# EAGLE schematic xio2 (EAGLE 9.2.2), part 1 of 2

## Sheet 1 of 19: Block diagram
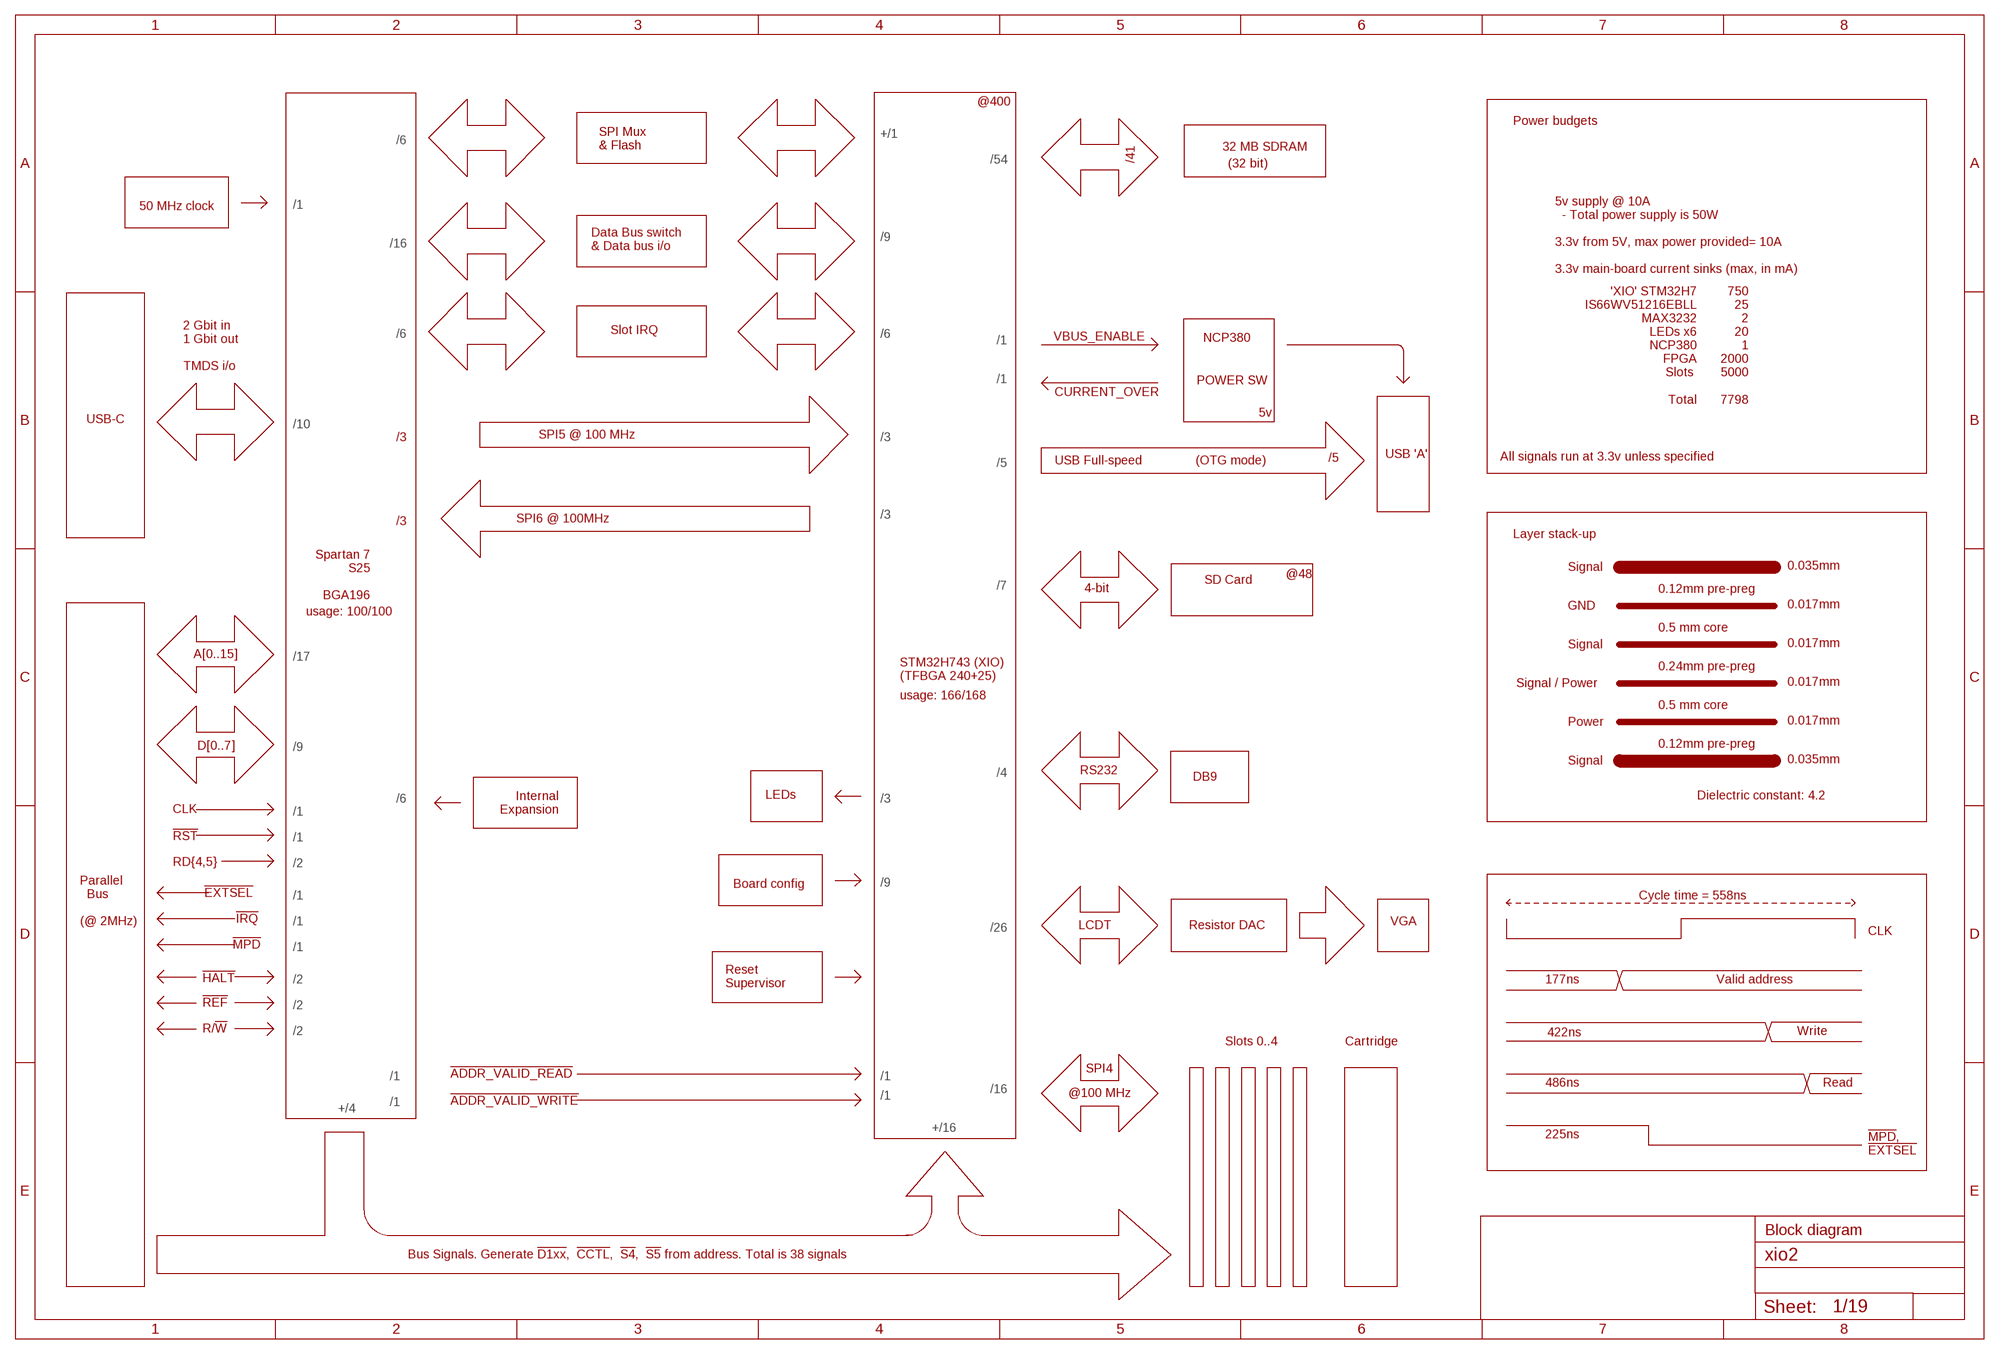
[diagram p0: schematic, sheet 1]

### Notes on the sheet
- @400
- Power budgets
- +/1
- /6 | /41
- SPI Mux
  & Flash
- 32 MB SDRAM
- /54
- (32 bit)
- 50 MHz clock | /1
- /9
- /16
- Data Bus switch
  & Data bus i/o
- 5v supply @ 10A
    - Total power supply is 50W
  
  3.3v from 5V, max power provided= 10A 
  
  3.3v main-board current sinks (max, in mA)
- 'XIO' STM32H7
  IS66WV51216EBLL
  MAX3232
  LEDs x6
  NCP380
  FPGA
  Slots 
  
  Total
- 750
  25
  2
  20
  1
  2000
  5000
  
  7798
- Slot IRQ | VBUS_ENABLE
- /6 | /6
- /1 | NCP380
- 2 Gbit in
  1 Gbit out
  
  TMDS i/o
- /1 | POWER SW
- CURRENT_OVER
- 5v
- USB-C
- /10 | SPI5 @ 100 MHz
- /3 | /3
- USB 'A' | All signals run at 3.3v unless specified
- USB Full-speed | (OTG mode) | /5
- /5
- SPI6 @ 100MHz
- /3
- /3
- Layer stack-up
- Spartan 7
      S25
  
   BGA196
- Signal | 0.035mm
- @48
- /7 | 4-bit | 0.12mm pre-preg
- SD Card
- GND | 0.017mm
- usage: 100/100
- 0.5 mm core
- Signal | 0.017mm
- A[0..15] | /17
- 0.24mm pre-preg
- STM32H743 (XIO)
  (TFBGA 240+25)
- Signal / Power | 0.017mm
- usage: 166/168
- 0.5 mm core
- Power | 0.017mm
- D[0..7] | /9 | 0.12mm pre-preg
- Signal | 0.035mm
- /4 | RS232
- DB9
- Internal
  Expansion
- LEDs | Dielectric constant: 4.2
- /6 | /3
- CLK | /1
- !RST! | /1
- RD{4,5} | /2
- !EXTSEL! | Board config | /9
- /1 | Cycle time = 558ns
- !IRQ!
- Parallel
    Bus
  
  (@ 2MHz)
- /1 | VGA
- /26 | LCDT | Resistor DAC
- CLK
- !MPD!
- /1
- !HALT! | /2 | 177ns | Valid address
- Reset
  Supervisor
- !REF! | /2
- R/!W! | /2 | Write
- 422ns
- Slots 0..4 | Cartridge
- SPI4
- /1 | !ADDR_VALID_READ! | /1
- @100 MHz | 486ns | Read
- /16
- /1
- /1 | !ADDR_VALID_WRITE!
- +/4
- +/16
- 225ns
- !MPD!,
  !EXTSEL!
- Block diagram
- Bus Signals. Generate !D1xx!,  !CCTL!,  !S4!,  !S5! from address. Total is 38 signals

## Sheet 2 of 19: XIO Power
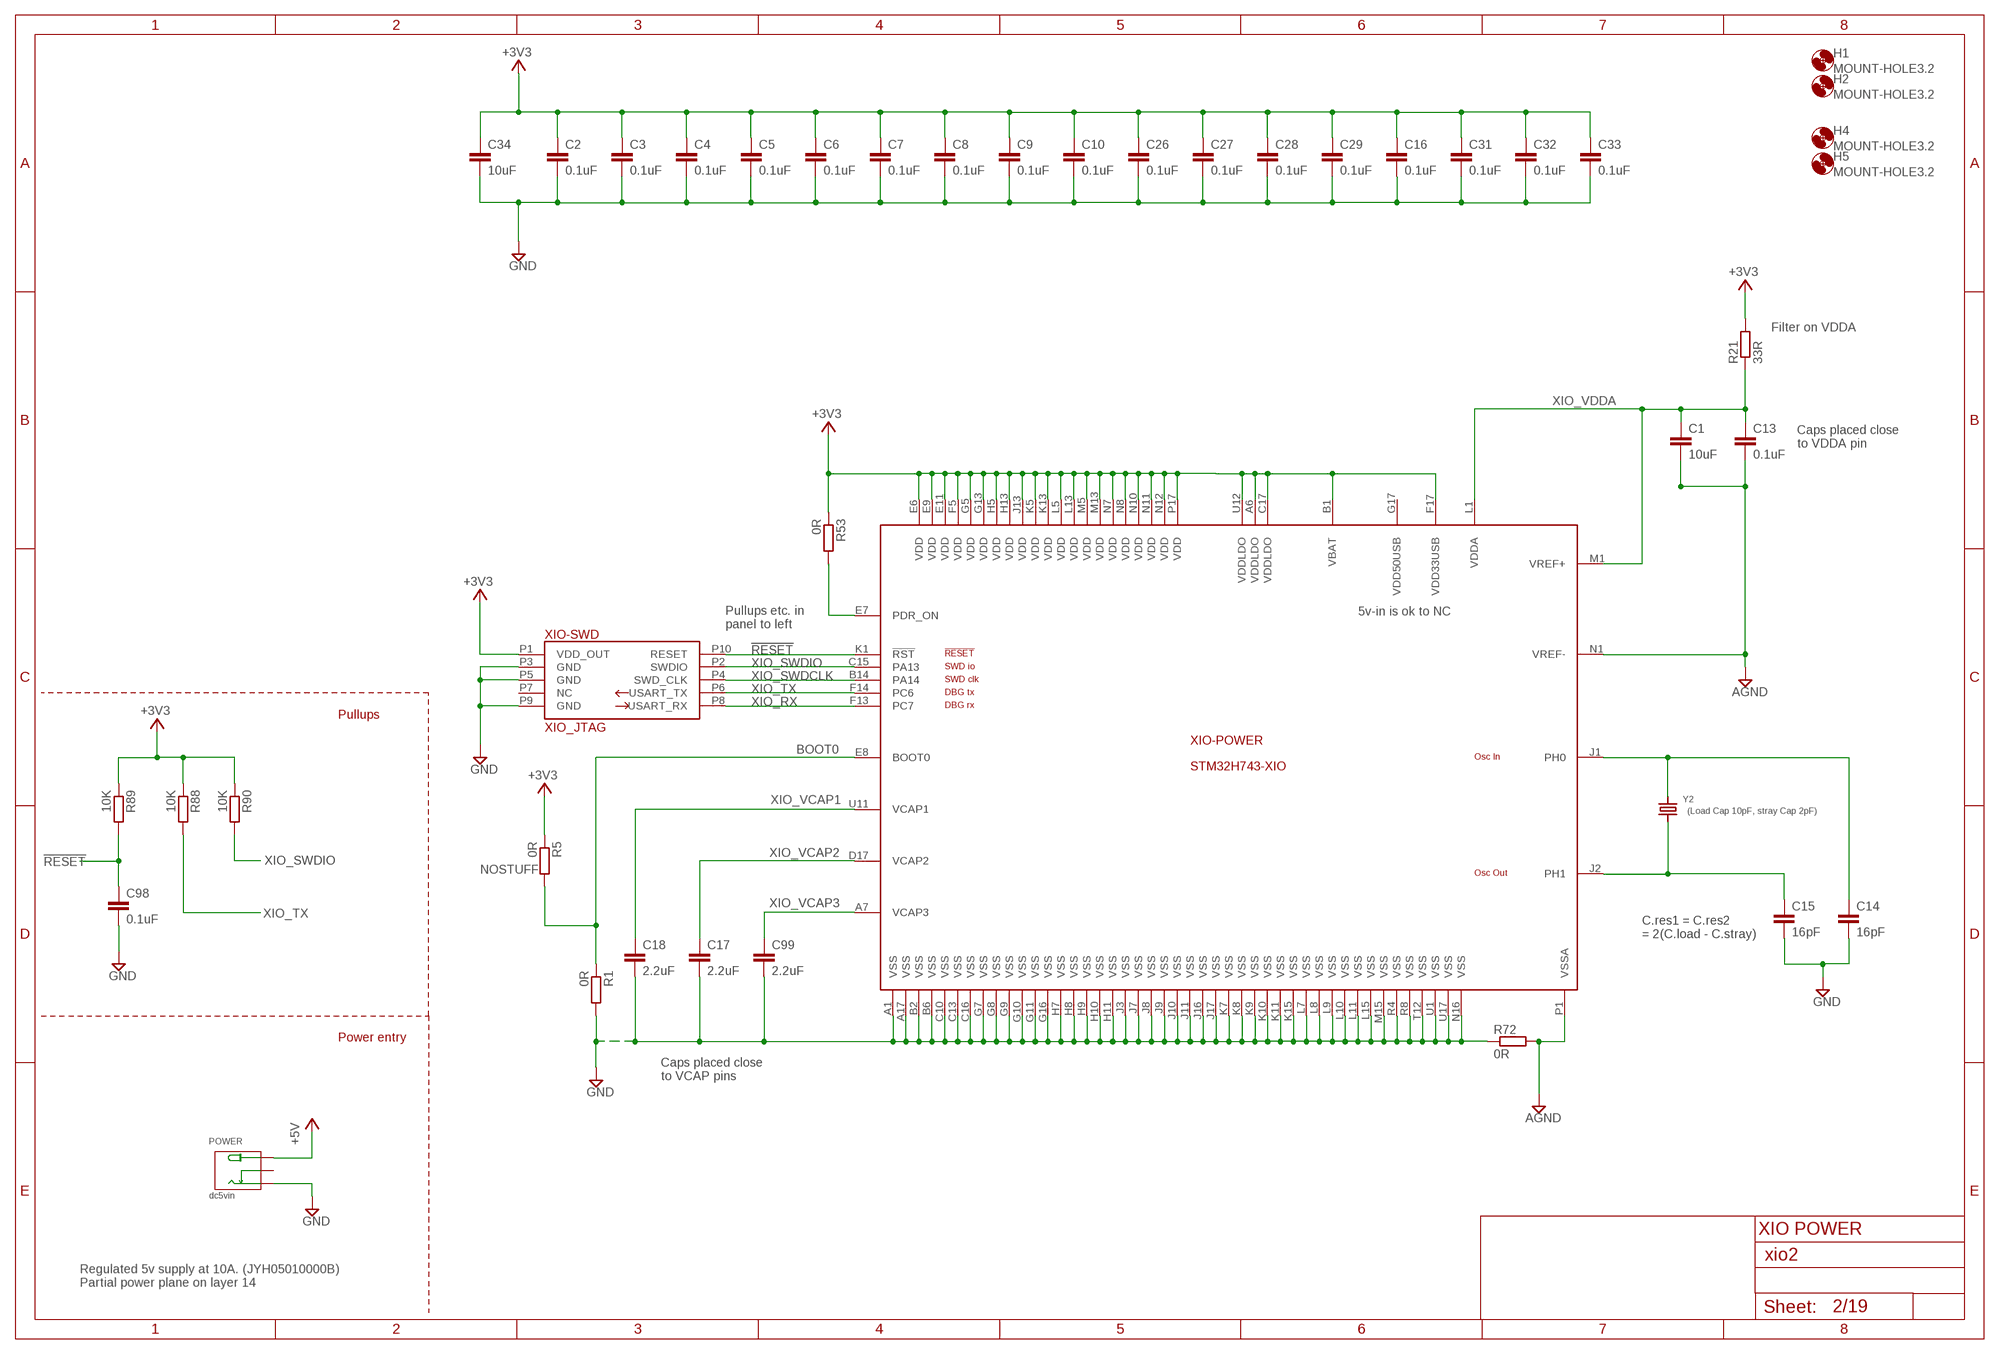
[diagram p1: schematic, sheet 2]

### Parts
C1  10uF  C-EUC0402K  [C0402K]
C2  0.1uF  C-EUC0201  [C0201]
C3  0.1uF  C-EUC0201  [C0201]
C4  0.1uF  C-EUC0201  [C0201]
C5  0.1uF  C-EUC0201  [C0201]
C6  0.1uF  C-EUC0201  [C0201]
C7  0.1uF  C-EUC0201  [C0201]
C8  0.1uF  C-EUC0201  [C0201]
C9  0.1uF  C-EUC0201  [C0201]
C10  0.1uF  C-EUC0201  [C0201]
C13  0.1uF  C-EUC0201  [C0201]
C14  16pF  C-EUC0201  [C0201]
C15  16pF  C-EUC0201  [C0201]
C16  0.1uF  C-EUC0201  [C0201]
C17  2.2uF  C-EUC0201  [C0201]
C18  2.2uF  C-EUC0201  [C0201]
C26  0.1uF  C-EUC0201  [C0201]
C27  0.1uF  C-EUC0201  [C0201]
C28  0.1uF  C-EUC0201  [C0201]
C29  0.1uF  C-EUC0201  [C0201]
C31  0.1uF  C-EUC0201  [C0201]
C32  0.1uF  C-EUC0201  [C0201]
C33  0.1uF  C-EUC0201  [C0201]
C34  10uF  C-EUC0402K  [C0402K]
C98  0.1uF  C-EUC0201  [C0201]
C99  2.2uF  C-EUC0201  [C0201]
H1  MOUNT-HOLE3.2  [3,2]
H2  MOUNT-HOLE3.2  [3,2]
H4  MOUNT-HOLE3.2  [3,2]
H5  MOUNT-HOLE3.2  [3,2]
POWER  dc5vin  CONN-POWER-JACK-2.1MM(DC-005)  [DCJ3P-14.2X11.0X9.0MM]
R1  0R  R-EU_R0201  [R0201]
R5  0R  R-EU_R0201  [R0201]
R21  33R  R-EU_R0201  [R0201]
R53  0R  R-EU_R0201  [R0201]
R72  0R  R-EU_R0201  [R0201]
R88  10K  R-EU_R0201  [R0201]
R89  10K  R-EU_R0201  [R0201]
R90  10K  R-EU_R0201  [R0201]
XIO  STM32H743-XIO  [BGA289C80P17X17_1400X1400X110]
XIO-SWD  XIO_JTAG  STM_DEBUG  [SWD_DEBUG]
Y2  FA-238 25.0000MB-K3  CRYSTALTHIN  [CRYSTAL_3.2X2.5]

### Nets
!RESET!: C98.1 R89.2 XIO-SWD.P10(RESET) XIO.K1(-POWER:!RST!) ; also sheet 4,6
+3V3 [lcd]: C2.1 C3.1 C4.1 C5.1 C6.1 C7.1 C8.1 C9.1 C10.1 C16.1 C26.1 C27.1 C28.1 C29.1 C31.1 C32.1 C33.1 C34.1 R5.1 R21.2 R53.1 R88.1 R89.1 R90.1 XIO-SWD.P1(VDD_OUT) XIO.A6(-POWER:VDDLDO) XIO.B1(-POWER:VBAT) XIO.C17(-POWER:VDDLDO) XIO.E6(-POWER:VDD) XIO.E9(-POWER:VDD) XIO.E11(-POWER:VDD) XIO.F5(-POWER:VDD) XIO.F17(-POWER:VDD33USB) XIO.G5(-POWER:VDD) XIO.G13(-POWER:VDD) XIO.H5(-POWER:VDD) XIO.H13(-POWER:VDD) XIO.J13(-POWER:VDD) XIO.K5(-POWER:VDD) XIO.K13(-POWER:VDD) XIO.L5(-POWER:VDD) XIO.L13(-POWER:VDD) XIO.M5(-POWER:VDD) XIO.M13(-POWER:VDD) XIO.N7(-POWER:VDD) XIO.N8(-POWER:VDD) XIO.N10(-POWER:VDD) XIO.N11(-POWER:VDD) XIO.N12(-POWER:VDD) XIO.P17(-POWER:VDD) XIO.U12(-POWER:VDDLDO) ; also sheet 4,5,6,7,9,10,11,12,13,14,15,16,17,18,19
+5V [Power]: POWER.+ ; also sheet 7,8,9,10,11,12,13,18,19
AGND: C1.2 C13.2 R72.2 XIO.N1(-POWER:VREF-) XIO.P1(-POWER:VSSA)
BOOT0: R1.1 R5.2 XIO.E8(-POWER:BOOT0)
GND: C2.2 C3.2 C4.2 C5.2 C6.2 C7.2 C8.2 C9.2 C10.2 C14.2 C15.2 C16.2 C17.2 C18.2 C26.2 C27.2 C28.2 C29.2 C31.2 C32.2 C33.2 C34.2 C98.2 C99.2 POWER.-1(-) R1.2 R72.1 XIO-SWD.P3(GND) XIO-SWD.P5(GND) XIO-SWD.P9(GND) XIO.A1(-POWER:VSS) XIO.A17(-POWER:VSS) XIO.B2(-POWER:VSS) XIO.B6(-POWER:VSS) XIO.C10(-POWER:VSS) XIO.C13(-POWER:VSS) XIO.C16(-POWER:VSS) XIO.G7(-POWER:VSS) XIO.G8(-POWER:VSS) XIO.G9(-POWER:VSS) XIO.G10(-POWER:VSS) XIO.G11(-POWER:VSS) XIO.G16(-POWER:VSS) XIO.H7(-POWER:VSS) XIO.H8(-POWER:VSS) XIO.H9(-POWER:VSS) XIO.H10(-POWER:VSS) XIO.H11(-POWER:VSS) XIO.J3(-POWER:VSS) XIO.J7(-POWER:VSS) XIO.J8(-POWER:VSS) XIO.J9(-POWER:VSS) XIO.J10(-POWER:VSS) XIO.J11(-POWER:VSS) XIO.J16(-POWER:VSS) XIO.J17(-POWER:VSS) XIO.K7(-POWER:VSS) XIO.K8(-POWER:VSS) XIO.K9(-POWER:VSS) XIO.K10(-POWER:VSS) XIO.K11(-POWER:VSS) XIO.K15(-POWER:VSS) XIO.L7(-POWER:VSS) XIO.L8(-POWER:VSS) XIO.L9(-POWER:VSS) XIO.L10(-POWER:VSS) XIO.L11(-POWER:VSS) XIO.L15(-POWER:VSS) XIO.M15(-POWER:VSS) XIO.N16(-POWER:VSS) XIO.R4(-POWER:VSS) XIO.R8(-POWER:VSS) XIO.T12(-POWER:VSS) XIO.U1(-POWER:VSS) XIO.U17(-POWER:VSS) ; also sheet 4,5,6,7,8,9,10,11,12,13,14,15,16,17,18,19
PDR_ON: R53.2 XIO.E7(-POWER:PDR_ON)
XIO_CLK_IN [clock]: C14.1 XIO.J1(-POWER:PH0) Y2.2
XIO_CLK_OUT [clock]: C15.1 XIO.J2(-POWER:PH1) Y2.1
XIO_RX: XIO-SWD.P8(USART_RX) XIO.F13(-POWER:PC7)
XIO_SWDCLK: XIO-SWD.P4(SWD_CLK) XIO.B14(-POWER:PA14)
XIO_SWDIO: R90.2 XIO-SWD.P2(SWDIO) XIO.C15(-POWER:PA13)
XIO_TX: R88.2 XIO-SWD.P6(USART_TX) XIO.F14(-POWER:PC6)
XIO_VCAP1: C18.1 XIO.U11(-POWER:VCAP1)
XIO_VCAP2: C17.1 XIO.D17(-POWER:VCAP2)
XIO_VCAP3: C99.1 XIO.A7(-POWER:VCAP3)
XIO_VDDA: C1.1 C13.1 R21.1 XIO.L1(-POWER:VDDA) XIO.M1(-POWER:VREF+)
Unconnected: POWER.-2(CDN) XIO-SWD.P7(NC) XIO.G17(-POWER:VDD50USB)

### Notes on the sheet
- Filter on VDDA
- Caps placed close 
  to VDDA pin
- 5v-in is ok to NC
- Pullups etc. in
  panel to left
- Pullups
- (Load Cap 10pF, stray Cap 2pF)
- C.res1 = C.res2 
  = 2(C.load - C.stray)
- Power entry
- Caps placed close 
  to VCAP pins
- XIO POWER
- Regulated 5v supply at 10A. (JYH05010000B)
  Partial power plane on layer 14

## Sheet 3 of 19: XIO SPI, IO-BUS
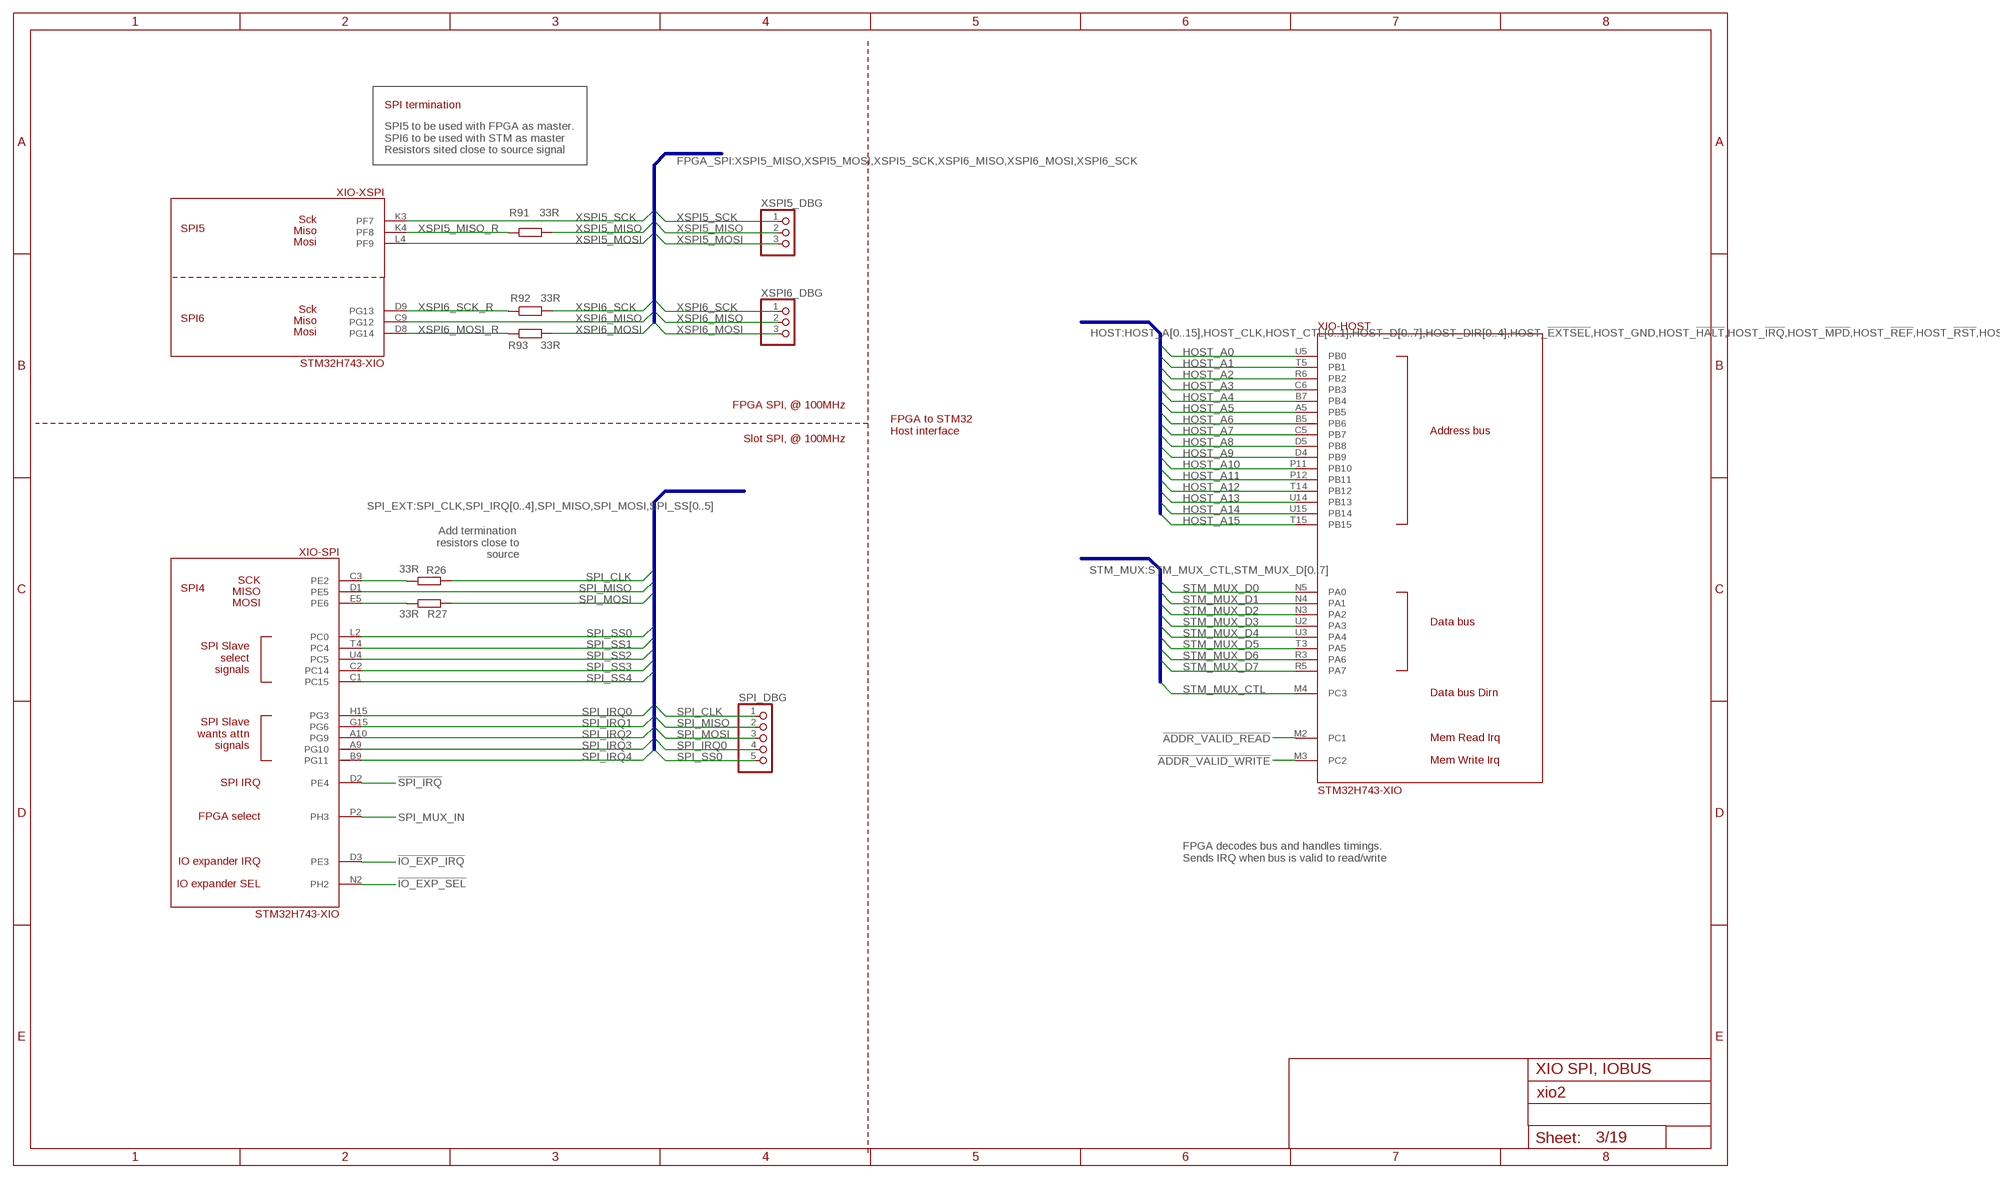
[diagram p2: schematic, sheet 3]

### Parts
R26  33R  R-EU_R0201  [R0201]
R27  33R  R-EU_R0201  [R0201]
R91  33R  R-EU_R0201  [R0201]
R92  33R  R-EU_R0201  [R0201]
R93  33R  R-EU_R0201  [R0201]
SPI_DBG  PINHD-1X5  [1X05]
XSPI5_DBG  PINHD-1X3  [1X03]
XSPI6_DBG  PINHD-1X3  [1X03]

### Nets
!ADDR_VALID_READ!: XIO.M2(-HOST:PC1) ; also sheet 17
!ADDR_VALID_WRITE!: XIO.M3(-HOST:PC2) ; also sheet 17
!IO_EXP_IRQ! [spi]: XIO.D3(-SPI:PE3) ; also sheet 6
!IO_EXP_SEL! [spi]: XIO.N2(-SPI:PH2) ; also sheet 6
!SPI_IRQ! [spi]: XIO.D2(-SPI:PE4) ; also sheet 17
HOST_A0: XIO.U5(-HOST:PB0) ; also sheet 10,11,12,16,18
HOST_A1: XIO.T5(-HOST:PB1) ; also sheet 10,11,12,16,18
HOST_A2: XIO.R6(-HOST:PB2) ; also sheet 10,11,12,16,18
HOST_A3: XIO.C6(-HOST:PB3) ; also sheet 10,11,12,16,18
HOST_A4: XIO.B7(-HOST:PB4) ; also sheet 10,11,12,16,18
HOST_A5: XIO.A5(-HOST:PB5) ; also sheet 10,11,12,16,18
HOST_A6: XIO.B5(-HOST:PB6) ; also sheet 10,11,12,16,18
HOST_A7: XIO.C5(-HOST:PB7) ; also sheet 10,11,12,16,18
HOST_A8: XIO.D5(-HOST:PB8) ; also sheet 10,11,12,16,18
HOST_A9: XIO.D4(-HOST:PB9) ; also sheet 10,11,12,16,18
HOST_A10: XIO.P11(-HOST:PB10) ; also sheet 10,11,12,16,18
HOST_A11: XIO.P12(-HOST:PB11) ; also sheet 10,11,12,16,18
HOST_A12: XIO.T14(-HOST:PB12) ; also sheet 10,11,12,16,18
HOST_A13: XIO.U14(-HOST:PB13) ; also sheet 10,11,12,16
HOST_A14: XIO.U15(-HOST:PB14) ; also sheet 10,11,12,16
HOST_A15: XIO.T15(-HOST:PB15) ; also sheet 10,11,12,16
N$57 [spi]: R26.2 XIO.C3(-SPI:PE2)
N$61 [spi]: R27.2 XIO.E5(-SPI:PE6)
SPI_CLK [spi]: R26.1 SPI_DBG.1 ; also sheet 6,10,11,12,15
SPI_IRQ0 [spi]: SPI_DBG.4 XIO.H15(-SPI:PG3) ; also sheet 10,17
SPI_IRQ1 [spi]: XIO.G15(-SPI:PG6) ; also sheet 10,17
SPI_IRQ2 [spi]: XIO.A10(-SPI:PG9) ; also sheet 11,17
SPI_IRQ3 [spi]: XIO.A9(-SPI:PG10) ; also sheet 11,17
SPI_IRQ4 [spi]: XIO.B9(-SPI:PG11) ; also sheet 12,17
SPI_MISO [spi]: SPI_DBG.2 XIO.D1(-SPI:PE5) ; also sheet 6,10,11,12,15
SPI_MOSI [spi]: R27.1 SPI_DBG.3 ; also sheet 6,10,11,12,15
SPI_MUX_IN [spi]: XIO.P2(-SPI:PH3) ; also sheet 15
SPI_SS0 [spi]: SPI_DBG.5 XIO.L2(-SPI:PC0) ; also sheet 10,19
SPI_SS1 [spi]: XIO.T4(-SPI:PC4) ; also sheet 10,19
SPI_SS2 [spi]: XIO.U4(-SPI:PC5) ; also sheet 11,19
SPI_SS3 [spi]: XIO.C2(-SPI:PC14) ; also sheet 11,19
SPI_SS4 [spi]: XIO.C1(-SPI:PC15) ; also sheet 12,19
STM_MUX_CTL: XIO.M4(-HOST:PC3) ; also sheet 17
STM_MUX_D0: XIO.N5(-HOST:PA0) ; also sheet 17
STM_MUX_D1: XIO.N4(-HOST:PA1) ; also sheet 17
STM_MUX_D2: XIO.N3(-HOST:PA2) ; also sheet 17
STM_MUX_D3: XIO.U2(-HOST:PA3) ; also sheet 17
STM_MUX_D4: XIO.U3(-HOST:PA4) ; also sheet 17
STM_MUX_D5: XIO.T3(-HOST:PA5) ; also sheet 17
STM_MUX_D6: XIO.R3(-HOST:PA6) ; also sheet 17
STM_MUX_D7: XIO.R5(-HOST:PA7) ; also sheet 17
XSPI5_MISO [xspi5]: R91.2 XSPI5_DBG.2 ; also sheet 17
XSPI5_MISO_R: R91.1 XIO.K4(-XSPI:PF8)
XSPI5_MOSI [xspi5]: XIO.L4(-XSPI:PF9) XSPI5_DBG.3 ; also sheet 17
XSPI5_SCK [xspi5]: XIO.K3(-XSPI:PF7) XSPI5_DBG.1 ; also sheet 17
XSPI6_MISO [xspi6]: XIO.C9(-XSPI:PG12) XSPI6_DBG.2 ; also sheet 17
XSPI6_MOSI [xspi6]: R93.2 XSPI6_DBG.3 ; also sheet 17
XSPI6_MOSI_R: R93.1 XIO.D8(-XSPI:PG14)
XSPI6_SCK [xspi6]: R92.2 XSPI6_DBG.1 ; also sheet 17
XSPI6_SCK_R: R92.1 XIO.D9(-XSPI:PG13)

### Buses
SPI_EXT:SPI_CLK,SPI_IRQ[0..4],SPI_MISO,SPI_MOSI,SPI_SS[0..5]
STM_MUX:STM_MUX_CTL,STM_MUX_D[0..7]
HOST:HOST_A[0..15],HOST_CLK,HOST_CTL[0..1],HOST_D[0..7],HOST_DIR[0..4],HOST_!EXTSEL!,HOST_GND,HOST_!HALT!,HOST_!IRQ!,HOST_!MPD!,HOST_!REF!,HOST_!RST!,HOST_R/!W!
FPGA_SPI:XSPI5_MISO,XSPI5_MOSI,XSPI5_SCK,XSPI6_MISO,XSPI6_MOSI,XSPI6_SCK

### Notes on the sheet
- SPI termination
- SPI5 to be used with FPGA as master. 
  SPI6 to be used with STM as master
  Resistors sited close to source signal
- FPGA SPI, @ 100MHz
- Slot SPI, @ 100MHz
- FPGA to STM32
  Host interface
- Add termination 
  resistors close to
  source
- FPGA decodes bus and handles timings. 
  Sends IRQ when bus is valid to read/write
- XIO SPI, IOBUS

## Sheet 4 of 19: Reset / GPIO / Leds / SD card
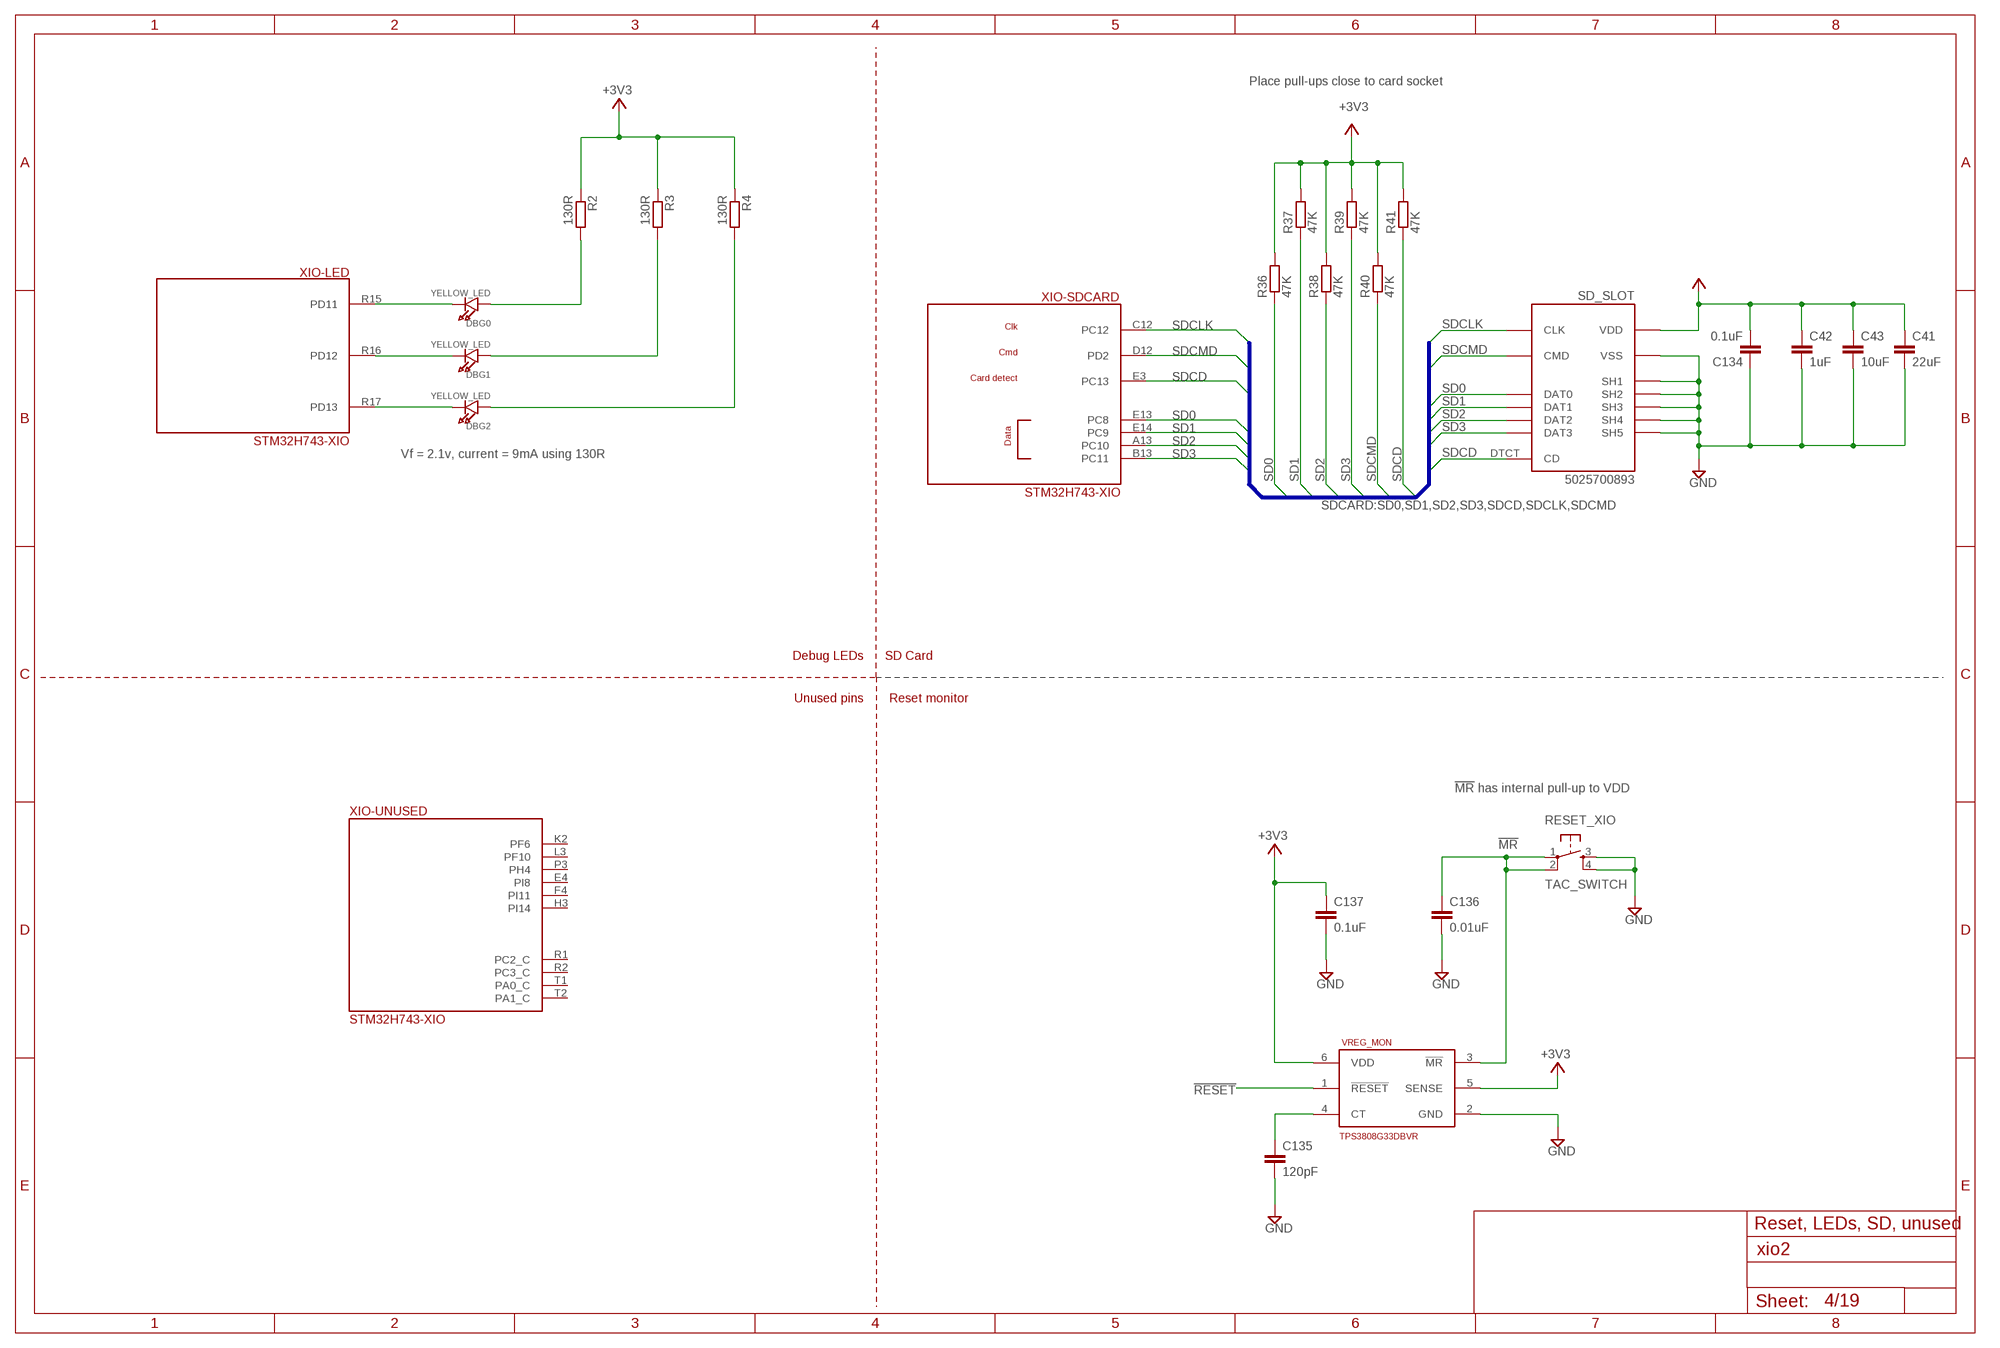
[diagram p3: schematic, sheet 4]

### Parts
C41  22uF  C-EUC0805  [C0805]
C42  1uF  C-EUC0201  [C0201]
C43  10uF  C-EUC0402K  [C0402K]
C134  0.1uF  C-EUC0201  [C0201]
C135  120pF  C-EUC0201  [C0201]
C136  0.01uF  C-EUC0201  [C0201]
C137  0.1uF  C-EUC0201  [C0201]
DBG0  YELLOW_LED  LED0603  [CHIPLED_0603]
DBG1  YELLOW_LED  LED0603  [CHIPLED_0603]
DBG2  YELLOW_LED  LED0603  [CHIPLED_0603]
R2  130R  R-EU_R0402  [R0402]
R3  130R  R-EU_R0402  [R0402]
R4  130R  R-EU_R0402  [R0402]
R36  47K  R-EU_R0402  [R0402]
R37  47K  R-EU_R0402  [R0402]
R38  47K  R-EU_R0402  [R0402]
R39  47K  R-EU_R0402  [R0402]
R40  47K  R-EU_R0402  [R0402]
R41  47K  R-EU_R0402  [R0402]
RESET_XIO  TAC_SWITCH  TAC_SWITCHPTH  [TACTILE-PTH]
SD_SLOT  5025700893  MICROSD_MOLEX_5025700893  [5025700893]
VREG_MON  TPS3808G33DBVR  TPS3808DBVR  [SOT23-6]

### Nets
!MR!: C136.1 RESET_XIO.1 RESET_XIO.2 VREG_MON.3(!MR!)
!RESET!: VREG_MON.1(!RESET!) ; also sheet 2,6
+3V3 [lcd]: C41.1 C42.1 C43.1 C134.2 C137.1 R2.1 R3.1 R4.1 R36.2 R37.2 R38.2 R39.2 R40.2 R41.2 SD_SLOT.P$4(VDD) VREG_MON.5(SENSE) VREG_MON.6(VDD) ; also sheet 2,5,6,7,9,10,11,12,13,14,15,16,17,18,19
GND: C41.2 C42.2 C43.2 C134.1 C135.2 C136.2 C137.2 RESET_XIO.3 RESET_XIO.4 SD_SLOT.GND0(SH1) SD_SLOT.GND1(SH2) SD_SLOT.GND2(SH3) SD_SLOT.GND3(SH4) SD_SLOT.GND4(SH5) SD_SLOT.P$6(VSS) VREG_MON.2(GND) ; also sheet 2,5,6,7,8,9,10,11,12,13,14,15,16,17,18,19
N$12: DBG0.A R2.2
N$13: DBG0.C XIO.R15(-LED:PD11)
N$14: DBG1.C XIO.R16(-LED:PD12)
N$15: DBG2.C XIO.R17(-LED:PD13)
N$16: DBG1.A R3.2
N$19: DBG2.A R4.2
N$60: C135.1 VREG_MON.4(CT)
SD0: R36.1 SD_SLOT.P$7(DAT0) XIO.E13(-SDCARD:PC8)
SD1: R37.1 SD_SLOT.P$8(DAT1) XIO.E14(-SDCARD:PC9)
SD2: R38.1 SD_SLOT.P$1(DAT2) XIO.A13(-SDCARD:PC10)
SD3: R39.1 SD_SLOT.P$2(DAT3) XIO.B13(-SDCARD:PC11)
SDCD: R41.1 SD_SLOT.DTCT(CD) XIO.E3(-SDCARD:PC13)
SDCLK: SD_SLOT.P$5(CLK) XIO.C12(-SDCARD:PC12)
SDCMD: R40.1 SD_SLOT.P$3(CMD) XIO.D12(-SDCARD:PD2)
Unconnected: XIO.E4(-UNUSED:PI8) XIO.F4(-UNUSED:PI11) XIO.H3(-UNUSED:PI14) XIO.K2(-UNUSED:PF6) XIO.L3(-UNUSED:PF10) XIO.P3(-UNUSED:PH4) XIO.R1(-UNUSED:PC2_C) XIO.R2(-UNUSED:PC3_C) XIO.T1(-UNUSED:PA0_C) XIO.T2(-UNUSED:PA1_C)

### Buses
SDCARD:SD0,SD1,SD2,SD3,SDCD,SDCLK,SDCMD

### Notes on the sheet
- Place pull-ups close to card socket
- Vf = 2.1v, current = 9mA using 130R
- Debug LEDs | SD Card
- Unused pins
- Reset monitor
- !MR! has internal pull-up to VDD
- Reset, LEDs, SD, unused

## Sheet 5 of 19: XIO SDRAM
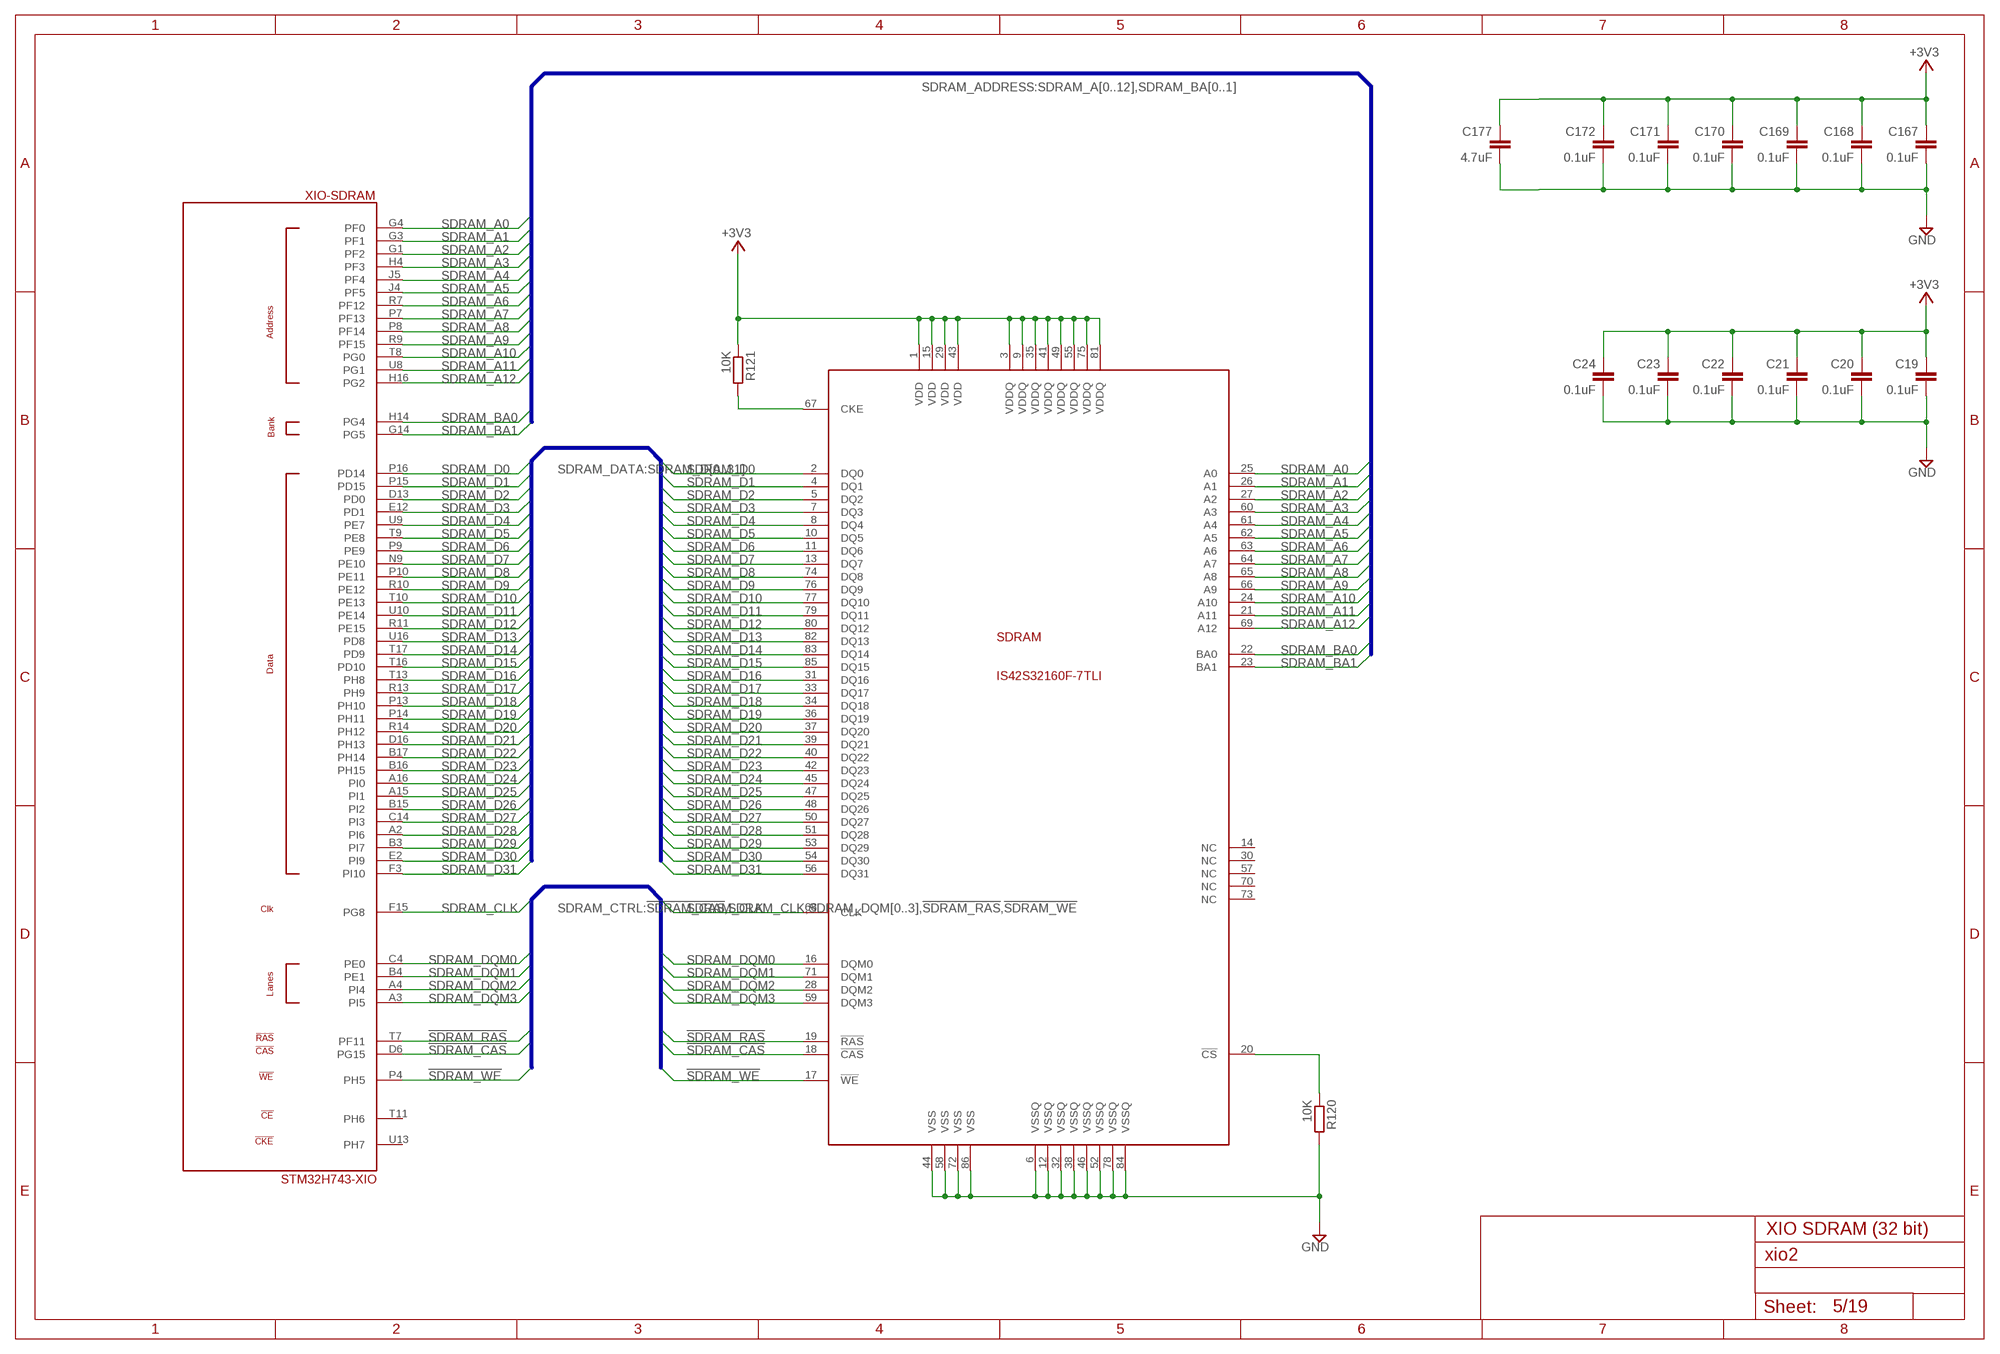
[diagram p4: schematic, sheet 5]

### Parts
C19  0.1uF  C-EUC0201  [C0201]
C20  0.1uF  C-EUC0201  [C0201]
C21  0.1uF  C-EUC0201  [C0201]
C22  0.1uF  C-EUC0201  [C0201]
C23  0.1uF  C-EUC0201  [C0201]
C24  0.1uF  C-EUC0201  [C0201]
C167  0.1uF  C-EUC0201  [C0201]
C168  0.1uF  C-EUC0201  [C0201]
C169  0.1uF  C-EUC0201  [C0201]
C170  0.1uF  C-EUC0201  [C0201]
C171  0.1uF  C-EUC0201  [C0201]
C172  0.1uF  C-EUC0201  [C0201]
C177  4.7uF  C-EUC0201  [C0201]
R120  10K  R-EU_R0201  [R0201]
R121  10K  R-EU_R0201  [R0201]
SDRAM  IS42S32160F-7TLI  [SOP50P1176X120-86]

### Nets
!SDRAM_CAS! [sdram]: SDRAM.18(!CAS!) XIO.D6(-SDRAM:PG15)
!SDRAM_RAS! [sdram]: SDRAM.19(!RAS!) XIO.T7(-SDRAM:PF11)
!SDRAM_WE! [sdram]: SDRAM.17(!WE!) XIO.P4(-SDRAM:PH5)
+3V3 [lcd]: C19.1 C20.1 C21.1 C22.1 C23.1 C24.1 C167.1 C168.1 C169.1 C170.1 C171.1 C172.1 C177.1 R121.1 SDRAM.1(VDD) SDRAM.3(VDDQ) SDRAM.9(VDDQ) SDRAM.15(VDD) SDRAM.29(VDD) SDRAM.35(VDDQ) SDRAM.41(VDDQ) SDRAM.43(VDD) SDRAM.49(VDDQ) SDRAM.55(VDDQ) SDRAM.75(VDDQ) SDRAM.81(VDDQ) ; also sheet 2,4,6,7,9,10,11,12,13,14,15,16,17,18,19
GND: C19.2 C20.2 C21.2 C22.2 C23.2 C24.2 C167.2 C168.2 C169.2 C170.2 C171.2 C172.2 C177.2 R120.2 SDRAM.6(VSSQ) SDRAM.12(VSSQ) SDRAM.32(VSSQ) SDRAM.38(VSSQ) SDRAM.44(VSS) SDRAM.46(VSSQ) SDRAM.52(VSSQ) SDRAM.58(VSS) SDRAM.72(VSS) SDRAM.78(VSSQ) SDRAM.84(VSSQ) SDRAM.86(VSS) ; also sheet 2,4,6,7,8,9,10,11,12,13,14,15,16,17,18,19
N$2 [lcd]: R121.2 SDRAM.67(CKE)
N$7 [lcd]: R120.1 SDRAM.20(!CS!)
SDRAM_A0 [sdram]: SDRAM.25(A0) XIO.G4(-SDRAM:PF0)
SDRAM_A1 [sdram]: SDRAM.26(A1) XIO.G3(-SDRAM:PF1)
SDRAM_A2 [sdram]: SDRAM.27(A2) XIO.G1(-SDRAM:PF2)
SDRAM_A3 [sdram]: SDRAM.60(A3) XIO.H4(-SDRAM:PF3)
SDRAM_A4 [sdram]: SDRAM.61(A4) XIO.J5(-SDRAM:PF4)
SDRAM_A5 [sdram]: SDRAM.62(A5) XIO.J4(-SDRAM:PF5)
SDRAM_A6 [sdram]: SDRAM.63(A6) XIO.R7(-SDRAM:PF12)
SDRAM_A7 [sdram]: SDRAM.64(A7) XIO.P7(-SDRAM:PF13)
SDRAM_A8 [sdram]: SDRAM.65(A8) XIO.P8(-SDRAM:PF14)
SDRAM_A9 [sdram]: SDRAM.66(A9) XIO.R9(-SDRAM:PF15)
SDRAM_A10 [sdram]: SDRAM.24(A10) XIO.T8(-SDRAM:PG0)
SDRAM_A11 [sdram]: SDRAM.21(A11) XIO.U8(-SDRAM:PG1)
SDRAM_A12: SDRAM.69(A12) XIO.H16(-SDRAM:PG2)
SDRAM_BA0 [sdram]: SDRAM.22(BA0) XIO.H14(-SDRAM:PG4)
SDRAM_BA1 [sdram]: SDRAM.23(BA1) XIO.G14(-SDRAM:PG5)
SDRAM_CLK [sdram]: SDRAM.68(CLK) XIO.F15(-SDRAM:PG8)
SDRAM_D0 [sdram]: SDRAM.2(DQ0) XIO.P16(-SDRAM:PD14)
SDRAM_D1 [sdram]: SDRAM.4(DQ1) XIO.P15(-SDRAM:PD15)
SDRAM_D2 [sdram]: SDRAM.5(DQ2) XIO.D13(-SDRAM:PD0)
SDRAM_D3 [sdram]: SDRAM.7(DQ3) XIO.E12(-SDRAM:PD1)
SDRAM_D4 [sdram]: SDRAM.8(DQ4) XIO.U9(-SDRAM:PE7)
SDRAM_D5 [sdram]: SDRAM.10(DQ5) XIO.T9(-SDRAM:PE8)
SDRAM_D6 [sdram]: SDRAM.11(DQ6) XIO.P9(-SDRAM:PE9)
SDRAM_D7 [sdram]: SDRAM.13(DQ7) XIO.N9(-SDRAM:PE10)
SDRAM_D8 [sdram]: SDRAM.74(DQ8) XIO.P10(-SDRAM:PE11)
SDRAM_D9 [sdram]: SDRAM.76(DQ9) XIO.R10(-SDRAM:PE12)
SDRAM_D10 [sdram]: SDRAM.77(DQ10) XIO.T10(-SDRAM:PE13)
SDRAM_D11 [sdram]: SDRAM.79(DQ11) XIO.U10(-SDRAM:PE14)
SDRAM_D12 [sdram]: SDRAM.80(DQ12) XIO.R11(-SDRAM:PE15)
SDRAM_D13 [sdram]: SDRAM.82(DQ13) XIO.U16(-SDRAM:PD8)
SDRAM_D14 [sdram]: SDRAM.83(DQ14) XIO.T17(-SDRAM:PD9)
SDRAM_D15 [sdram]: SDRAM.85(DQ15) XIO.T16(-SDRAM:PD10)
SDRAM_D16 [sdram]: SDRAM.31(DQ16) XIO.T13(-SDRAM:PH8)
SDRAM_D17 [sdram]: SDRAM.33(DQ17) XIO.R13(-SDRAM:PH9)
SDRAM_D18 [sdram]: SDRAM.34(DQ18) XIO.P13(-SDRAM:PH10)
SDRAM_D19 [sdram]: SDRAM.36(DQ19) XIO.P14(-SDRAM:PH11)
SDRAM_D20 [sdram]: SDRAM.37(DQ20) XIO.R14(-SDRAM:PH12)
SDRAM_D21 [sdram]: SDRAM.39(DQ21) XIO.D16(-SDRAM:PH13)
SDRAM_D22 [sdram]: SDRAM.40(DQ22) XIO.B17(-SDRAM:PH14)
SDRAM_D23 [sdram]: SDRAM.42(DQ23) XIO.B16(-SDRAM:PH15)
SDRAM_D24 [sdram]: SDRAM.45(DQ24) XIO.A16(-SDRAM:PI0)
SDRAM_D25 [sdram]: SDRAM.47(DQ25) XIO.A15(-SDRAM:PI1)
SDRAM_D26 [sdram]: SDRAM.48(DQ26) XIO.B15(-SDRAM:PI2)
SDRAM_D27 [sdram]: SDRAM.50(DQ27) XIO.C14(-SDRAM:PI3)
SDRAM_D28 [sdram]: SDRAM.51(DQ28) XIO.A2(-SDRAM:PI6)
SDRAM_D29 [sdram]: SDRAM.53(DQ29) XIO.B3(-SDRAM:PI7)
SDRAM_D30 [sdram]: SDRAM.54(DQ30) XIO.E2(-SDRAM:PI9)
SDRAM_D31 [sdram]: SDRAM.56(DQ31) XIO.F3(-SDRAM:PI10)
SDRAM_DQM0 [sdram]: SDRAM.16(DQM0) XIO.C4(-SDRAM:PE0)
SDRAM_DQM1 [sdram]: SDRAM.71(DQM1) XIO.B4(-SDRAM:PE1)
SDRAM_DQM2 [sdram]: SDRAM.28(DQM2) XIO.A4(-SDRAM:PI4)
SDRAM_DQM3 [sdram]: SDRAM.59(DQM3) XIO.A3(-SDRAM:PI5)
Unconnected: SDRAM.14(NC) SDRAM.30(NC) SDRAM.57(NC) SDRAM.70(NC) SDRAM.73(NC) XIO.T11(-SDRAM:PH6) XIO.U13(-SDRAM:PH7)

### Buses
SDRAM_CTRL:!SDRAM_CAS!,SDRAM_CLK,SDRAM_DQM[0..3],!SDRAM_RAS!,!SDRAM_WE!
SDRAM_DATA:SDRAM_D[0..31]
SDRAM_ADDRESS:SDRAM_A[0..12],SDRAM_BA[0..1]

### Notes on the sheet
- XIO SDRAM (32 bit)

## Sheet 6 of 19: XIO Serial I/O
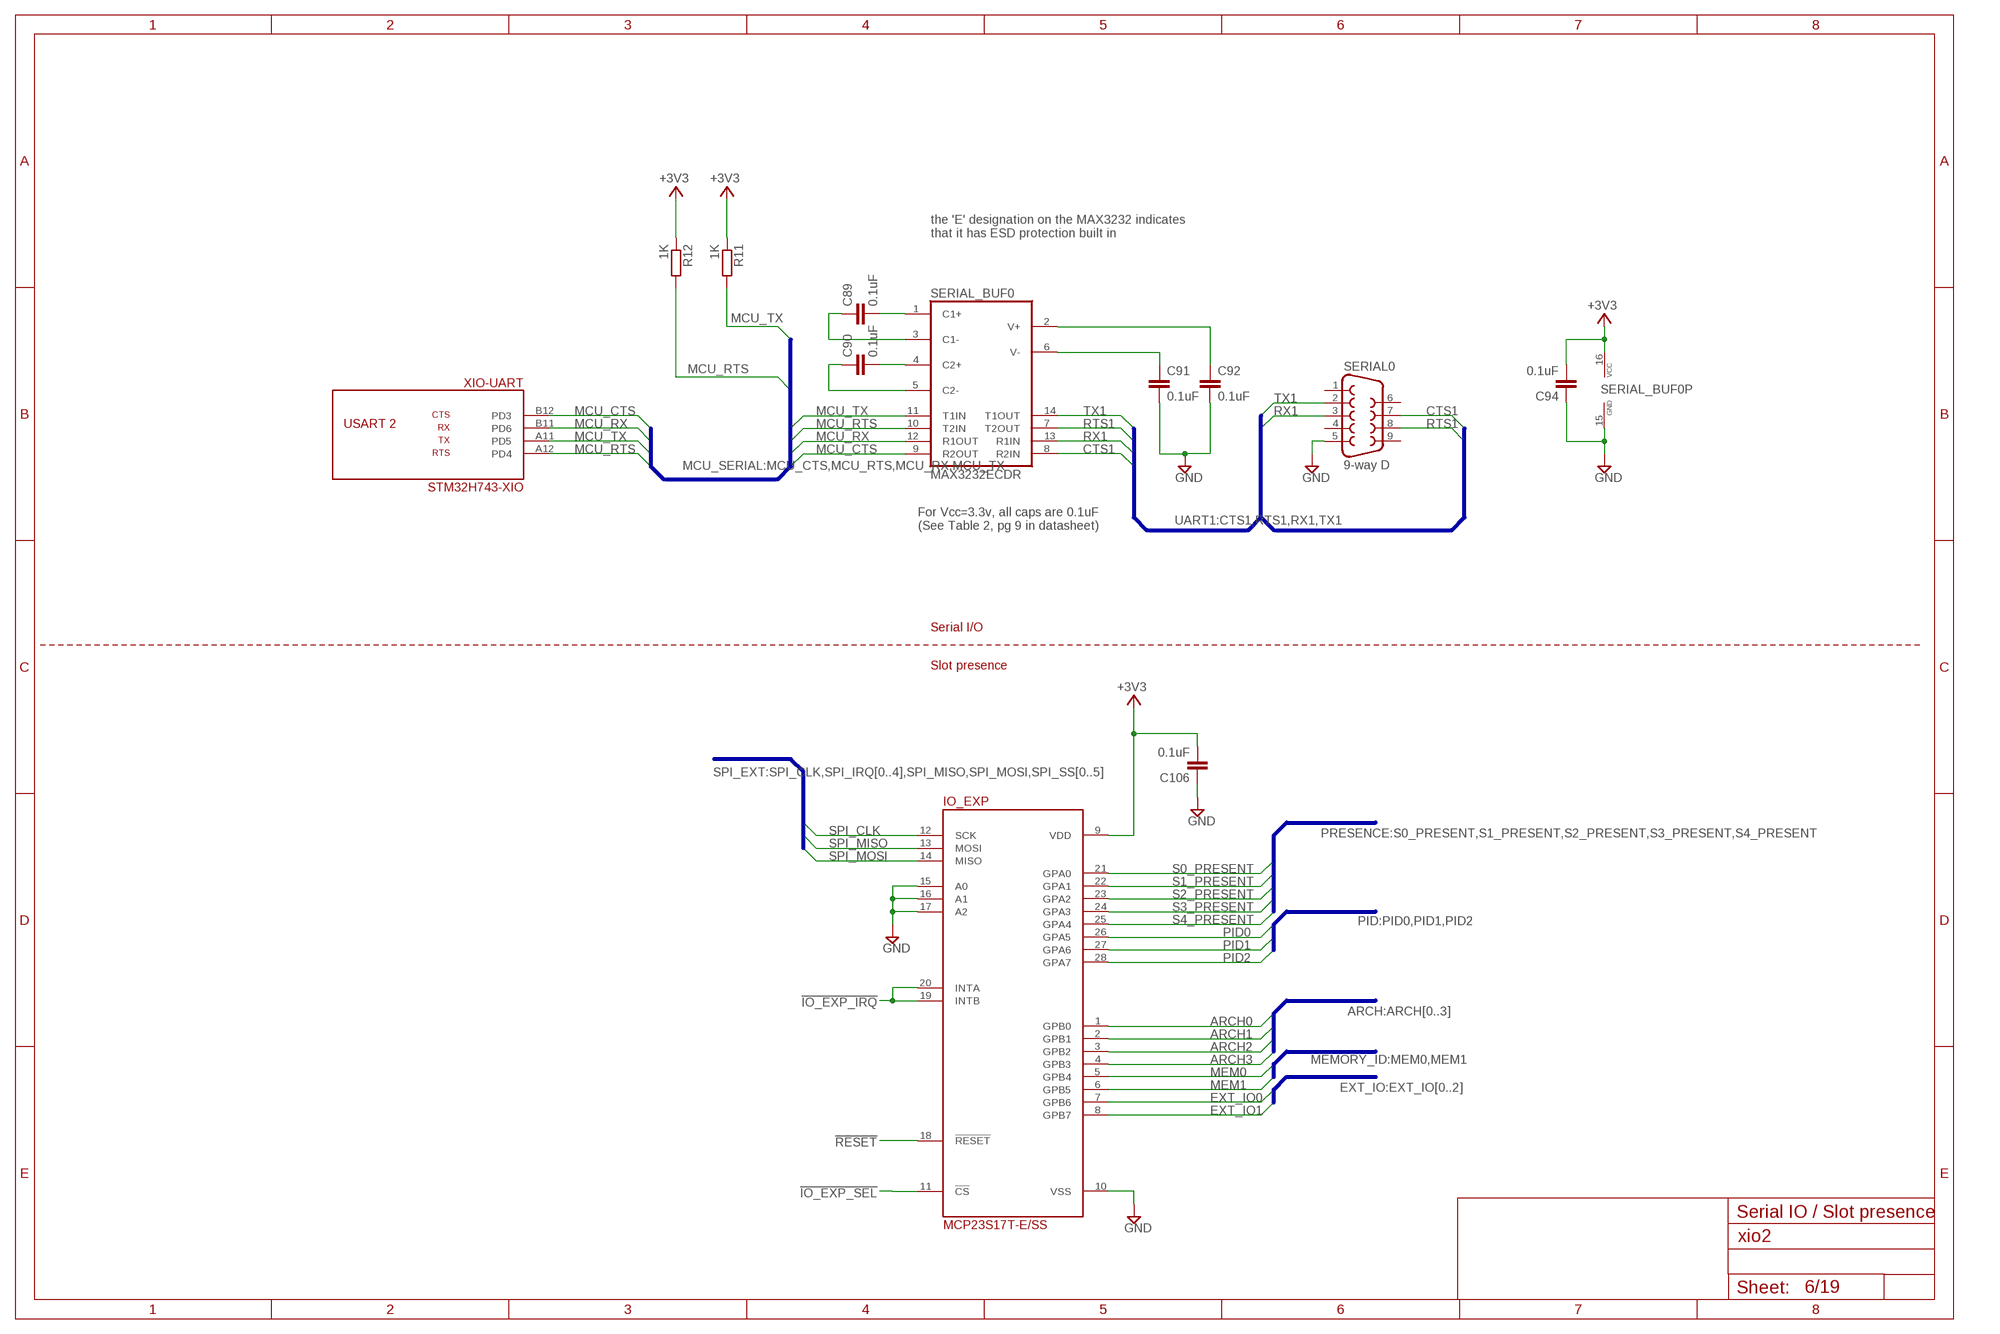
[diagram p5: schematic, sheet 6]

### Parts
C89  0.1uF  C-EUC0201  [C0201]
C90  0.1uF  C-EUC0201  [C0201]
C91  0.1uF  C-EUC0201  [C0201]
C92  0.1uF  C-EUC0201  [C0201]
C94  0.1uF  C-EUC0201  [C0201]
C106  0.1uF  C-EUC0201  [C0201]
IO_EXP  MCP23S17T-E/SS  [SSOP28]
R11  1K  R-EU_R0201  [R0201]
R12  1K  R-EU_R0201  [R0201]
SERIAL0  9-way D  DB9  [DB9]
SERIAL_BUF0  MAX3232ECDR  MAX3232CSE  [SO16]

### Nets
!IO_EXP_IRQ! [spi]: IO_EXP.19(INTB) IO_EXP.20(INTA) ; also sheet 3
!IO_EXP_SEL! [spi]: IO_EXP.11(!CS!) ; also sheet 3
!RESET!: IO_EXP.18(!RESET!) ; also sheet 2,4
+3V3 [lcd]: C94.2 C106.2 IO_EXP.9(VDD) R11.1 R12.1 SERIAL_BUF0.16(VCC) ; also sheet 2,4,5,7,9,10,11,12,13,14,15,16,17,18,19
ARCH0: IO_EXP.1(GPB0) ; also sheet 7
ARCH1: IO_EXP.2(GPB1) ; also sheet 7
ARCH2: IO_EXP.3(GPB2) ; also sheet 7
ARCH3: IO_EXP.4(GPB3) ; also sheet 7
CTS1: SERIAL0.7 SERIAL_BUF0.8(R2IN)
EXT_IO0: IO_EXP.7(GPB6) ; also sheet 17
EXT_IO1: IO_EXP.8(GPB7) ; also sheet 17
GND: C91.2 C92.2 C94.1 C106.1 IO_EXP.10(VSS) IO_EXP.15(A0) IO_EXP.16(A1) IO_EXP.17(A2) SERIAL0.5 SERIAL_BUF0.15(GND) ; also sheet 2,4,5,7,8,9,10,11,12,13,14,15,16,17,18,19
MCU_CTS: SERIAL_BUF0.9(R2OUT) XIO.B12(-UART:PD3)
MCU_RTS: R12.2 SERIAL_BUF0.10(T2IN) XIO.A12(-UART:PD4)
MCU_RX: SERIAL_BUF0.12(R1OUT) XIO.B11(-UART:PD6)
MCU_TX: R11.2 SERIAL_BUF0.11(T1IN) XIO.A11(-UART:PD5)
MEM0: IO_EXP.5(GPB4) ; also sheet 7
MEM1: IO_EXP.6(GPB5) ; also sheet 7
N$28: C89.2 SERIAL_BUF0.1(C1+)
N$29: C89.1 SERIAL_BUF0.3(C1-)
N$30: C90.2 SERIAL_BUF0.4(C2+)
N$31: C90.1 SERIAL_BUF0.5(C2-)
N$32: C91.1 SERIAL_BUF0.6(V-)
N$33: C92.1 SERIAL_BUF0.2(V+)
PID0: IO_EXP.26(GPA5) ; also sheet 7
PID1: IO_EXP.27(GPA6) ; also sheet 7
PID2: IO_EXP.28(GPA7) ; also sheet 7
RTS1: SERIAL0.8 SERIAL_BUF0.7(T2OUT)
RX1: SERIAL0.3 SERIAL_BUF0.13(R1IN)
S0_PRESENT: IO_EXP.21(GPA0) ; also sheet 10,19
S1_PRESENT: IO_EXP.22(GPA1) ; also sheet 10,19
S2_PRESENT: IO_EXP.23(GPA2) ; also sheet 11,19
S3_PRESENT: IO_EXP.24(GPA3) ; also sheet 11,19
S4_PRESENT: IO_EXP.25(GPA4) ; also sheet 12,19
SPI_CLK [spi]: IO_EXP.12(SCK) ; also sheet 3,10,11,12,15
SPI_MISO [spi]: IO_EXP.13(MOSI) ; also sheet 3,10,11,12,15
SPI_MOSI [spi]: IO_EXP.14(MISO) ; also sheet 3,10,11,12,15
TX1: SERIAL0.2 SERIAL_BUF0.14(T1OUT)
Unconnected: SERIAL0.1 SERIAL0.4 SERIAL0.6 SERIAL0.9

### Buses
UART1:CTS1,RTS1,RX1,TX1
MCU_SERIAL:MCU_CTS,MCU_RTS,MCU_RX,MCU_TX
SPI_EXT:SPI_CLK,SPI_IRQ[0..4],SPI_MISO,SPI_MOSI,SPI_SS[0..5]
PRESENCE:S0_PRESENT,S1_PRESENT,S2_PRESENT,S3_PRESENT,S4_PRESENT
EXT_IO:EXT_IO[0..2]
PID:PID0,PID1,PID2
ARCH:ARCH[0..3]
MEMORY_ID:MEM0,MEM1

### Notes on the sheet
- the 'E' designation on the MAX3232 indicates
  that it has ESD protection built in
- For Vcc=3.3v, all caps are 0.1uF
  (See Table 2, pg 9 in datasheet)
- Serial I/O
- Slot presence
- Serial IO / Slot presence

## Sheet 7 of 19: Board config
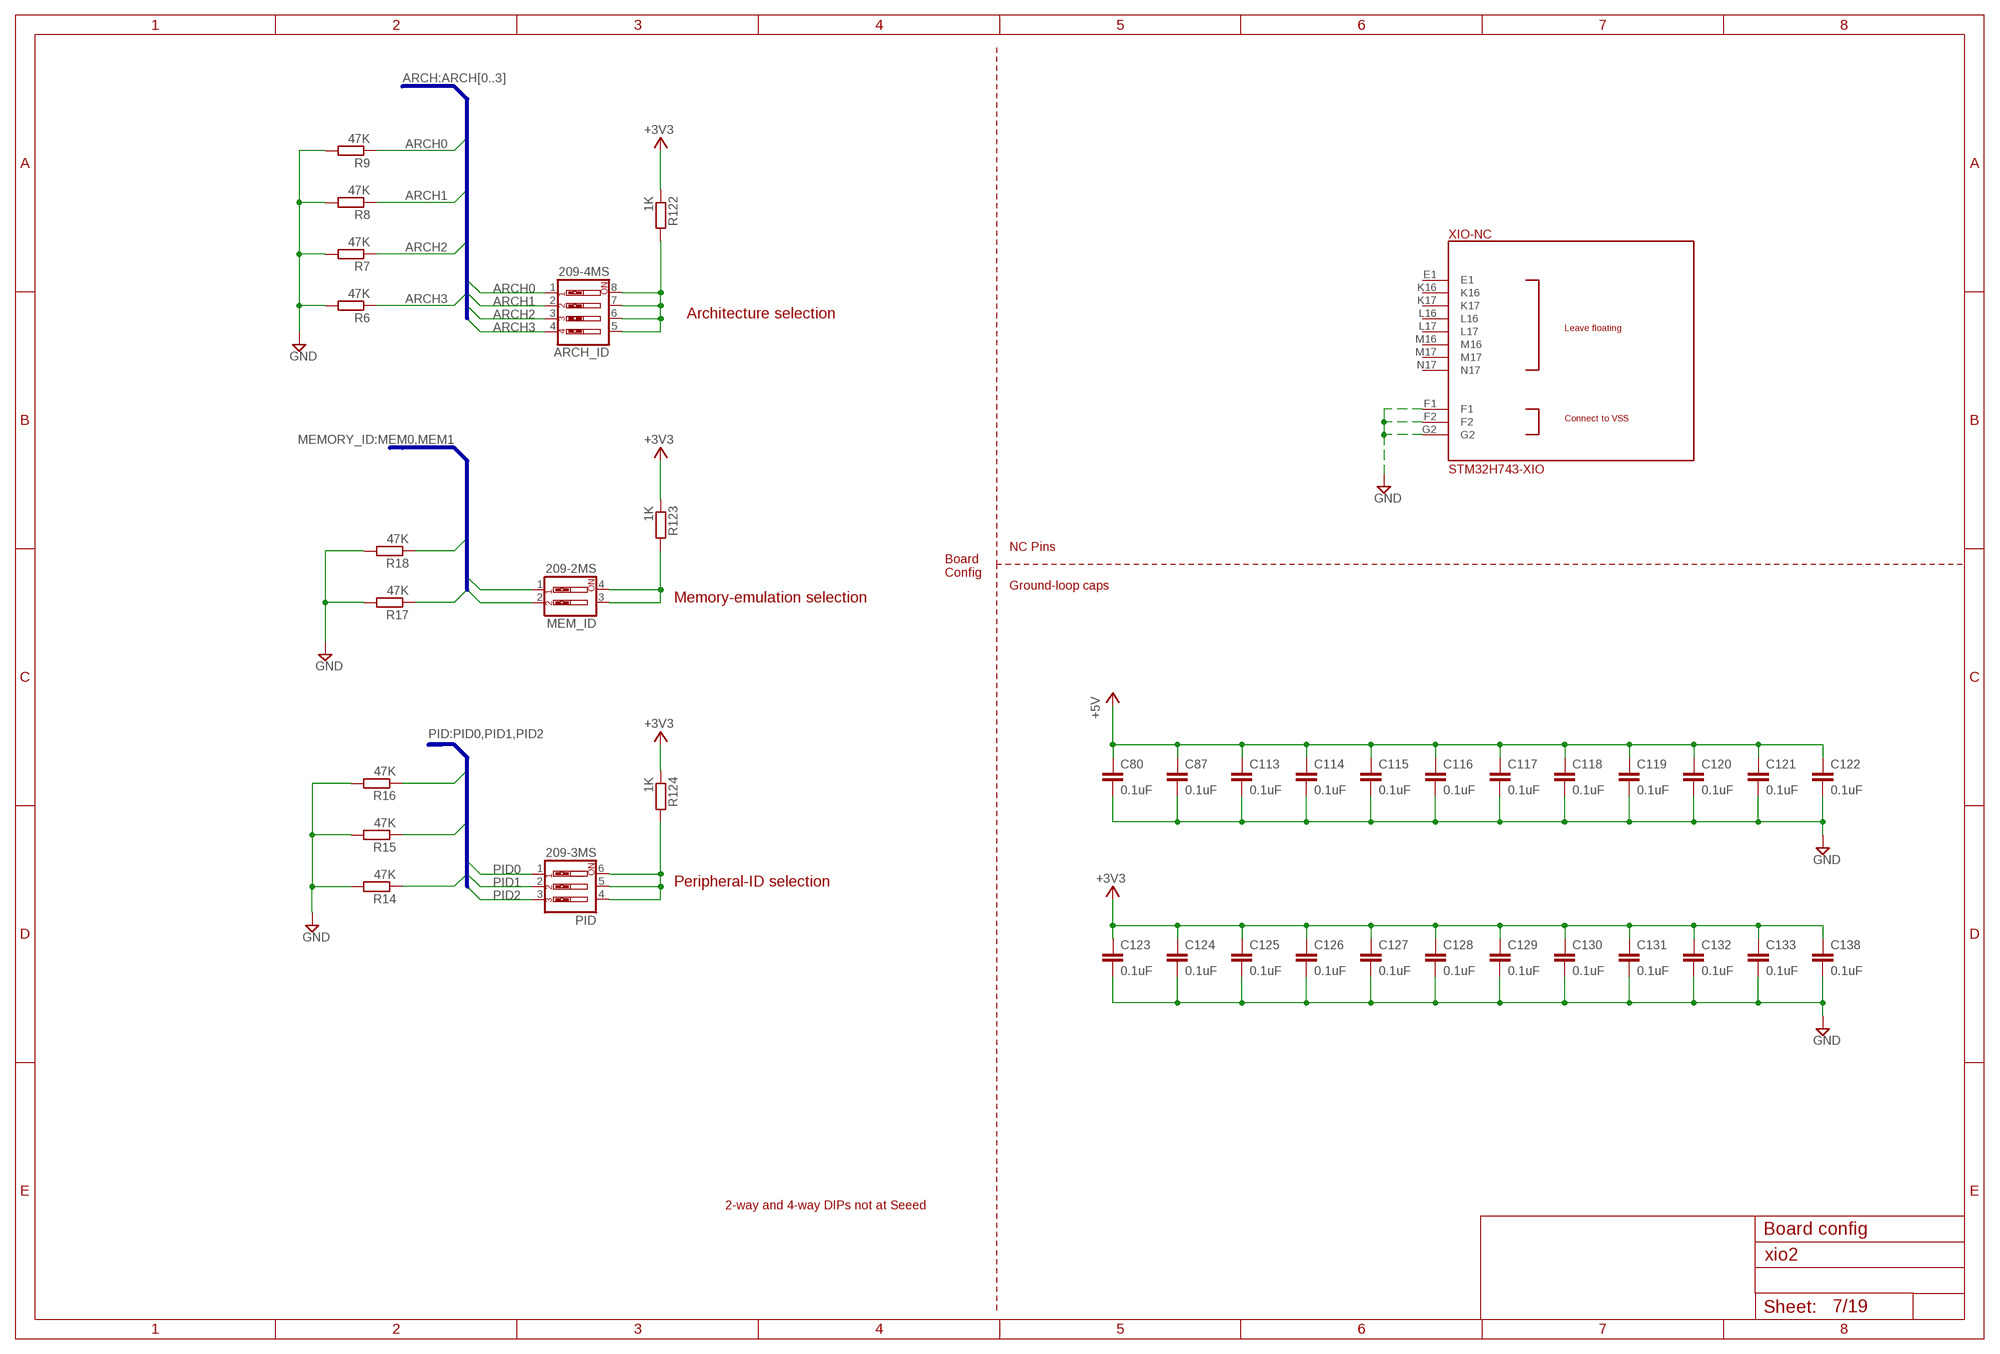
[diagram p6: schematic, sheet 7]

### Parts
ARCH_ID  209-4MS  SW_DIP-4  [EDG-04]
C80  0.1uF  C-EUC0201  [C0201]
C87  0.1uF  C-EUC0201  [C0201]
C113  0.1uF  C-EUC0201  [C0201]
C114  0.1uF  C-EUC0201  [C0201]
C115  0.1uF  C-EUC0201  [C0201]
C116  0.1uF  C-EUC0201  [C0201]
C117  0.1uF  C-EUC0201  [C0201]
C118  0.1uF  C-EUC0201  [C0201]
C119  0.1uF  C-EUC0201  [C0201]
C120  0.1uF  C-EUC0201  [C0201]
C121  0.1uF  C-EUC0201  [C0201]
C122  0.1uF  C-EUC0201  [C0201]
C123  0.1uF  C-EUC0201  [C0201]
C124  0.1uF  C-EUC0201  [C0201]
C125  0.1uF  C-EUC0201  [C0201]
C126  0.1uF  C-EUC0201  [C0201]
C127  0.1uF  C-EUC0201  [C0201]
C128  0.1uF  C-EUC0201  [C0201]
C129  0.1uF  C-EUC0201  [C0201]
C130  0.1uF  C-EUC0201  [C0201]
C131  0.1uF  C-EUC0201  [C0201]
C132  0.1uF  C-EUC0201  [C0201]
C133  0.1uF  C-EUC0201  [C0201]
C138  0.1uF  C-EUC0201  [C0201]
MEM_ID  209-2MS  SW_DIP-2  [EDG-02]
PID  209-3MS  SW_DIP-3  [EDG-03]
R6  47K  R-EU_R0201  [R0201]
R7  47K  R-EU_R0201  [R0201]
R8  47K  R-EU_R0201  [R0201]
R9  47K  R-EU_R0201  [R0201]
R14  47K  R-EU_R0201  [R0201]
R15  47K  R-EU_R0201  [R0201]
R16  47K  R-EU_R0201  [R0201]
R17  47K  R-EU_R0201  [R0201]
R18  47K  R-EU_R0201  [R0201]
R122  1K  R-EU_R0201  [R0201]
R123  1K  R-EU_R0201  [R0201]
R124  1K  R-EU_R0201  [R0201]

### Nets
+3V3 [lcd]: C123.1 C124.1 C125.1 C126.1 C127.1 C128.1 C129.1 C130.1 C131.1 C132.1 C133.1 C138.1 R122.1 R123.1 R124.1 ; also sheet 2,4,5,6,9,10,11,12,13,14,15,16,17,18,19
+5V [Power]: C80.1 C87.1 C113.1 C114.1 C115.1 C116.1 C117.1 C118.1 C119.1 C120.1 C121.1 C122.1 ; also sheet 2,8,9,10,11,12,13,18,19
ARCH0: ARCH_ID.1 R9.1 ; also sheet 6
ARCH1: ARCH_ID.2 R8.1 ; also sheet 6
ARCH2: ARCH_ID.3 R7.1 ; also sheet 6
ARCH3: ARCH_ID.4 R6.1 ; also sheet 6
GND: C80.2 C87.2 C113.2 C114.2 C115.2 C116.2 C117.2 C118.2 C119.2 C120.2 C121.2 C122.2 C123.2 C124.2 C125.2 C126.2 C127.2 C128.2 C129.2 C130.2 C131.2 C132.2 C133.2 C138.2 R6.2 R7.2 R8.2 R9.2 R14.2 R15.2 R16.2 R17.2 R18.2 XIO.F1(-NC:F1) XIO.F2(-NC:F2) XIO.G2(-NC:G2) ; also sheet 2,4,5,6,8,9,10,11,12,13,14,15,16,17,18,19
MEM0: MEM_ID.1 R18.1 ; also sheet 6
MEM1: MEM_ID.2 R17.1 ; also sheet 6
N$11 [lcd]: ARCH_ID.5 ARCH_ID.6 ARCH_ID.7 ARCH_ID.8 R122.2
N$48 [lcd]: MEM_ID.3 MEM_ID.4 R123.2
N$49 [lcd]: PID.4 PID.5 PID.6 R124.2
PID0: PID.1 R16.1 ; also sheet 6
PID1: PID.2 R15.1 ; also sheet 6
PID2: PID.3 R14.1 ; also sheet 6
Unconnected: XIO.E1(-NC:E1) XIO.K16(-NC:K16) XIO.K17(-NC:K17) XIO.L16(-NC:L16) XIO.L17(-NC:L17) XIO.M16(-NC:M16) XIO.M17(-NC:M17) XIO.N17(-NC:N17)

### Buses
PID:PID0,PID1,PID2
MEMORY_ID:MEM0,MEM1
ARCH:ARCH[0..3]

### Notes on the sheet
- Architecture selection
- NC Pins
- Board
  Config
- Ground-loop caps
- Memory-emulation selection
- Peripheral-ID selection
- 2-way and 4-way DIPs not at Seeed
- Board config

## Sheet 8 of 19: XIO USB OTG
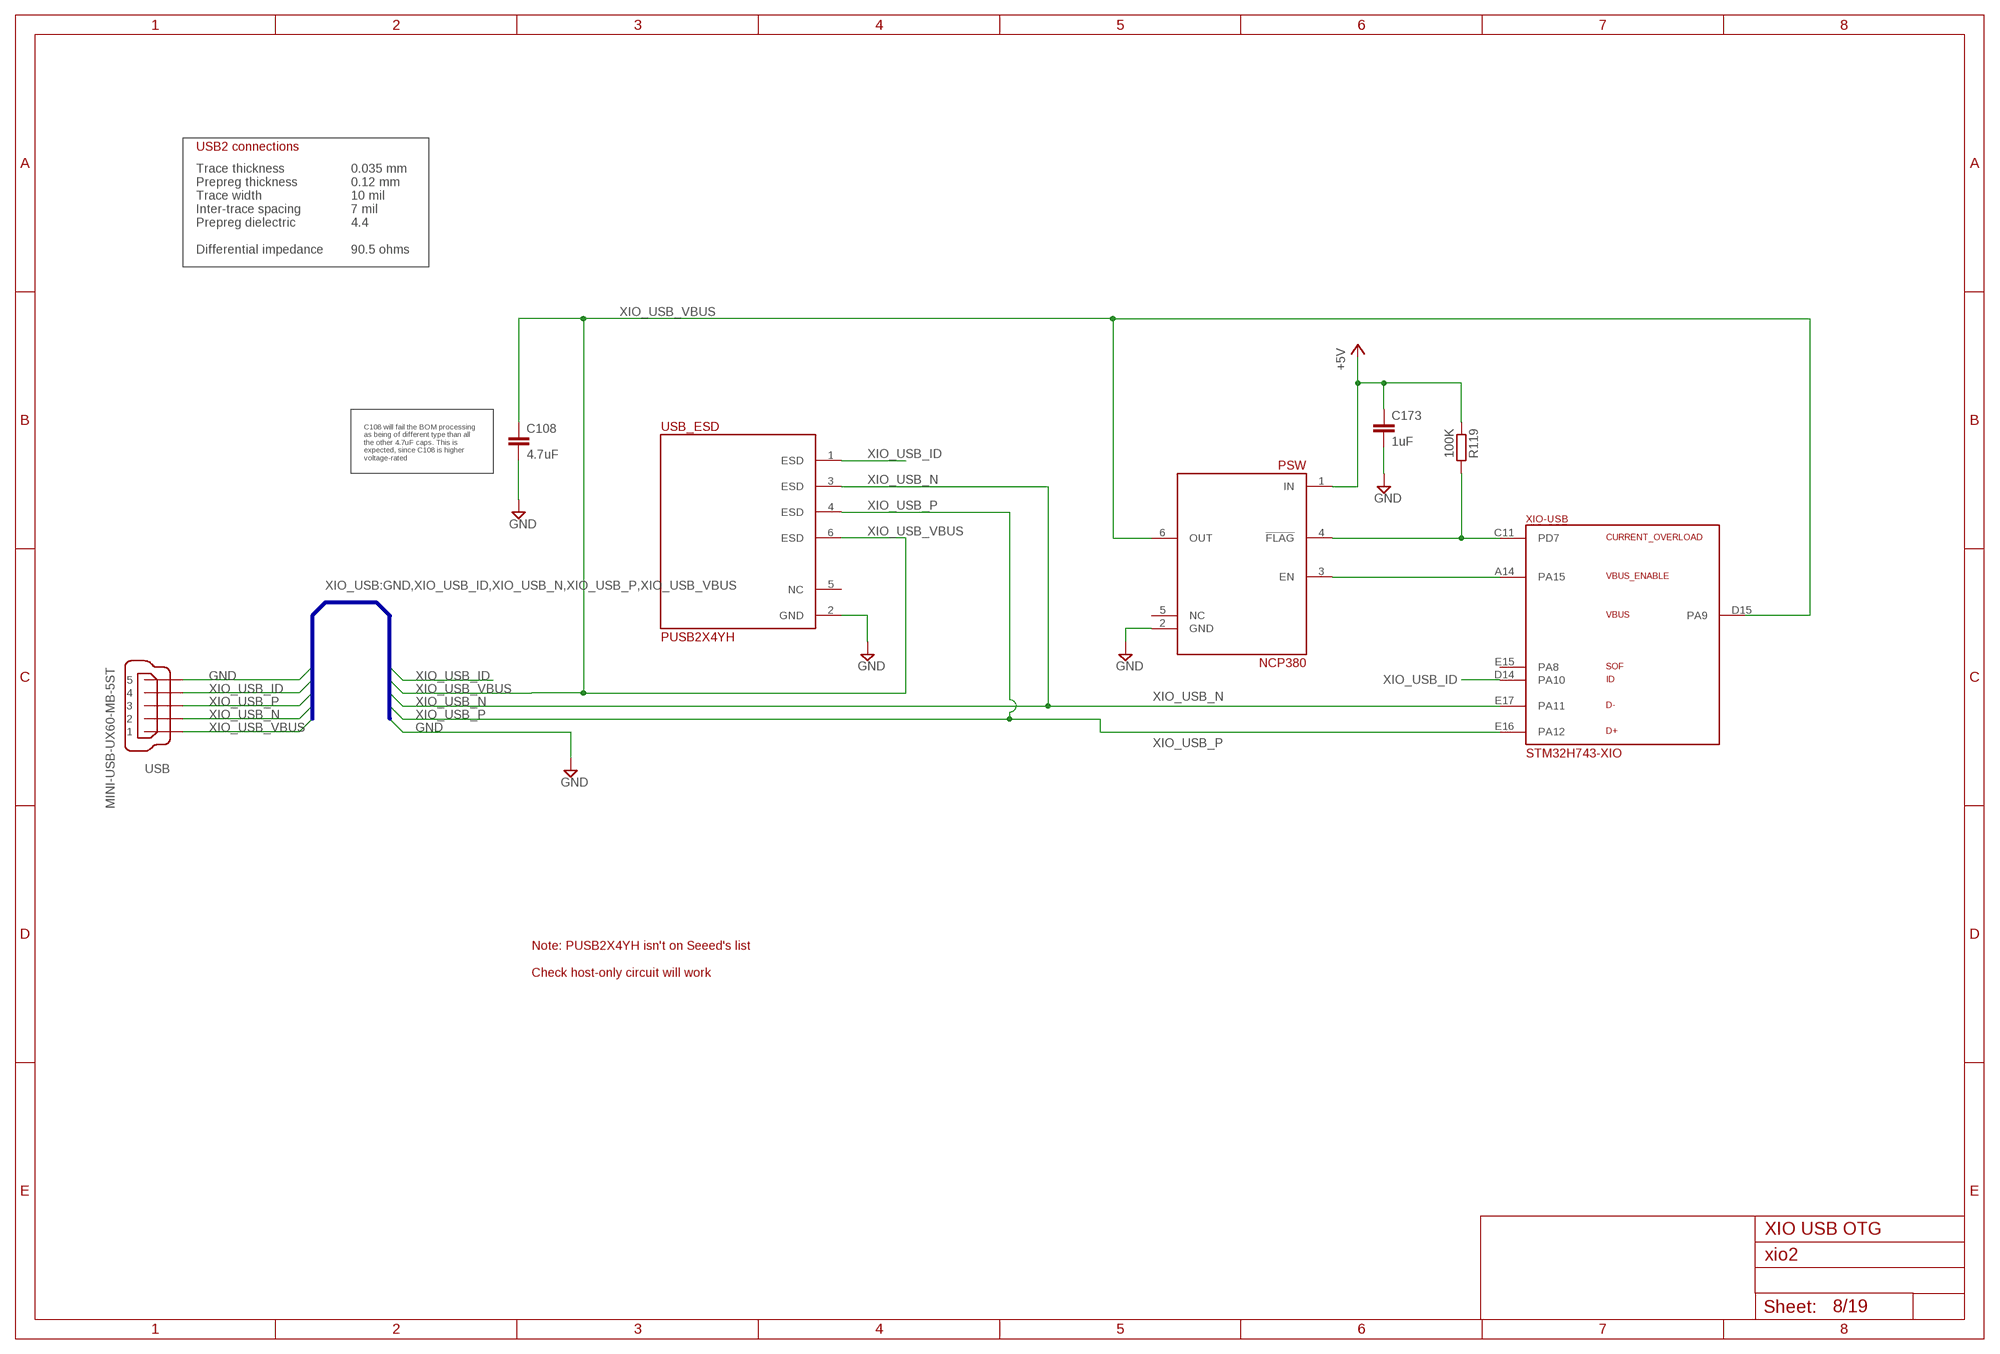
[diagram p7: schematic, sheet 8]

### Parts
C108  4.7uF  C-EUC0402  [C0402]
C173  1uF  C-EUC0201  [C0201]
PSW  NCP380  [SOT23-6]
R119  100K  R-EU_R0201  [R0201]
USB  MINI-USB-UX60-MB-5ST  [UX60-MB-5ST]
USB_ESD  PUSB2X4YH  [SOT363]

### Nets
+5V [Power]: C173.1 PSW.1(IN) R119.1 ; also sheet 2,7,9,10,11,12,13,18,19
GND: C108.2 C173.2 PSW.2(GND) USB.5 USB_ESD.2(GND) ; also sheet 2,4,5,6,7,9,10,11,12,13,14,15,16,17,18,19
N$1: PSW.3(EN) XIO.A14(-USB:PA15)
N$65: PSW.4(!FLAG!) R119.2 XIO.C11(-USB:PD7)
XIO_USB_ID: USB.4 USB_ESD.1(ESD) XIO.D14(-USB:PA10)
XIO_USB_N [usb90]: USB.2 USB_ESD.3(ESD) XIO.E17(-USB:PA11)
XIO_USB_P [usb90]: USB.3 USB_ESD.4(ESD) XIO.E16(-USB:PA12)
XIO_USB_VBUS: C108.1 PSW.6(OUT) USB.1 USB_ESD.6(ESD) XIO.D15(-USB:PA9)
Unconnected: PSW.5(NC) USB_ESD.5(NC) XIO.E15(-USB:PA8)

### Buses
XIO_USB:GND,XIO_USB_ID,XIO_USB_N,XIO_USB_P,XIO_USB_VBUS

### Notes on the sheet
- USB2 connections
- Trace thickness
  Prepreg thickness
  Trace width
  Inter-trace spacing
  Prepreg dielectric
  
  Differential impedance
- 0.035 mm
  0.12 mm
  10 mil
  7 mil
  4.4
  
  90.5 ohms
- C108 will fail the BOM processing
  as being of different type than all
  the other 4.7uF caps. This is 
  expected, since C108 is higher 
  voltage-rated
- Note: PUSB2X4YH isn't on Seeed's list
  
  Check host-only circuit will work
- XIO USB OTG

## Sheet 9 of 19: LTDC VGA
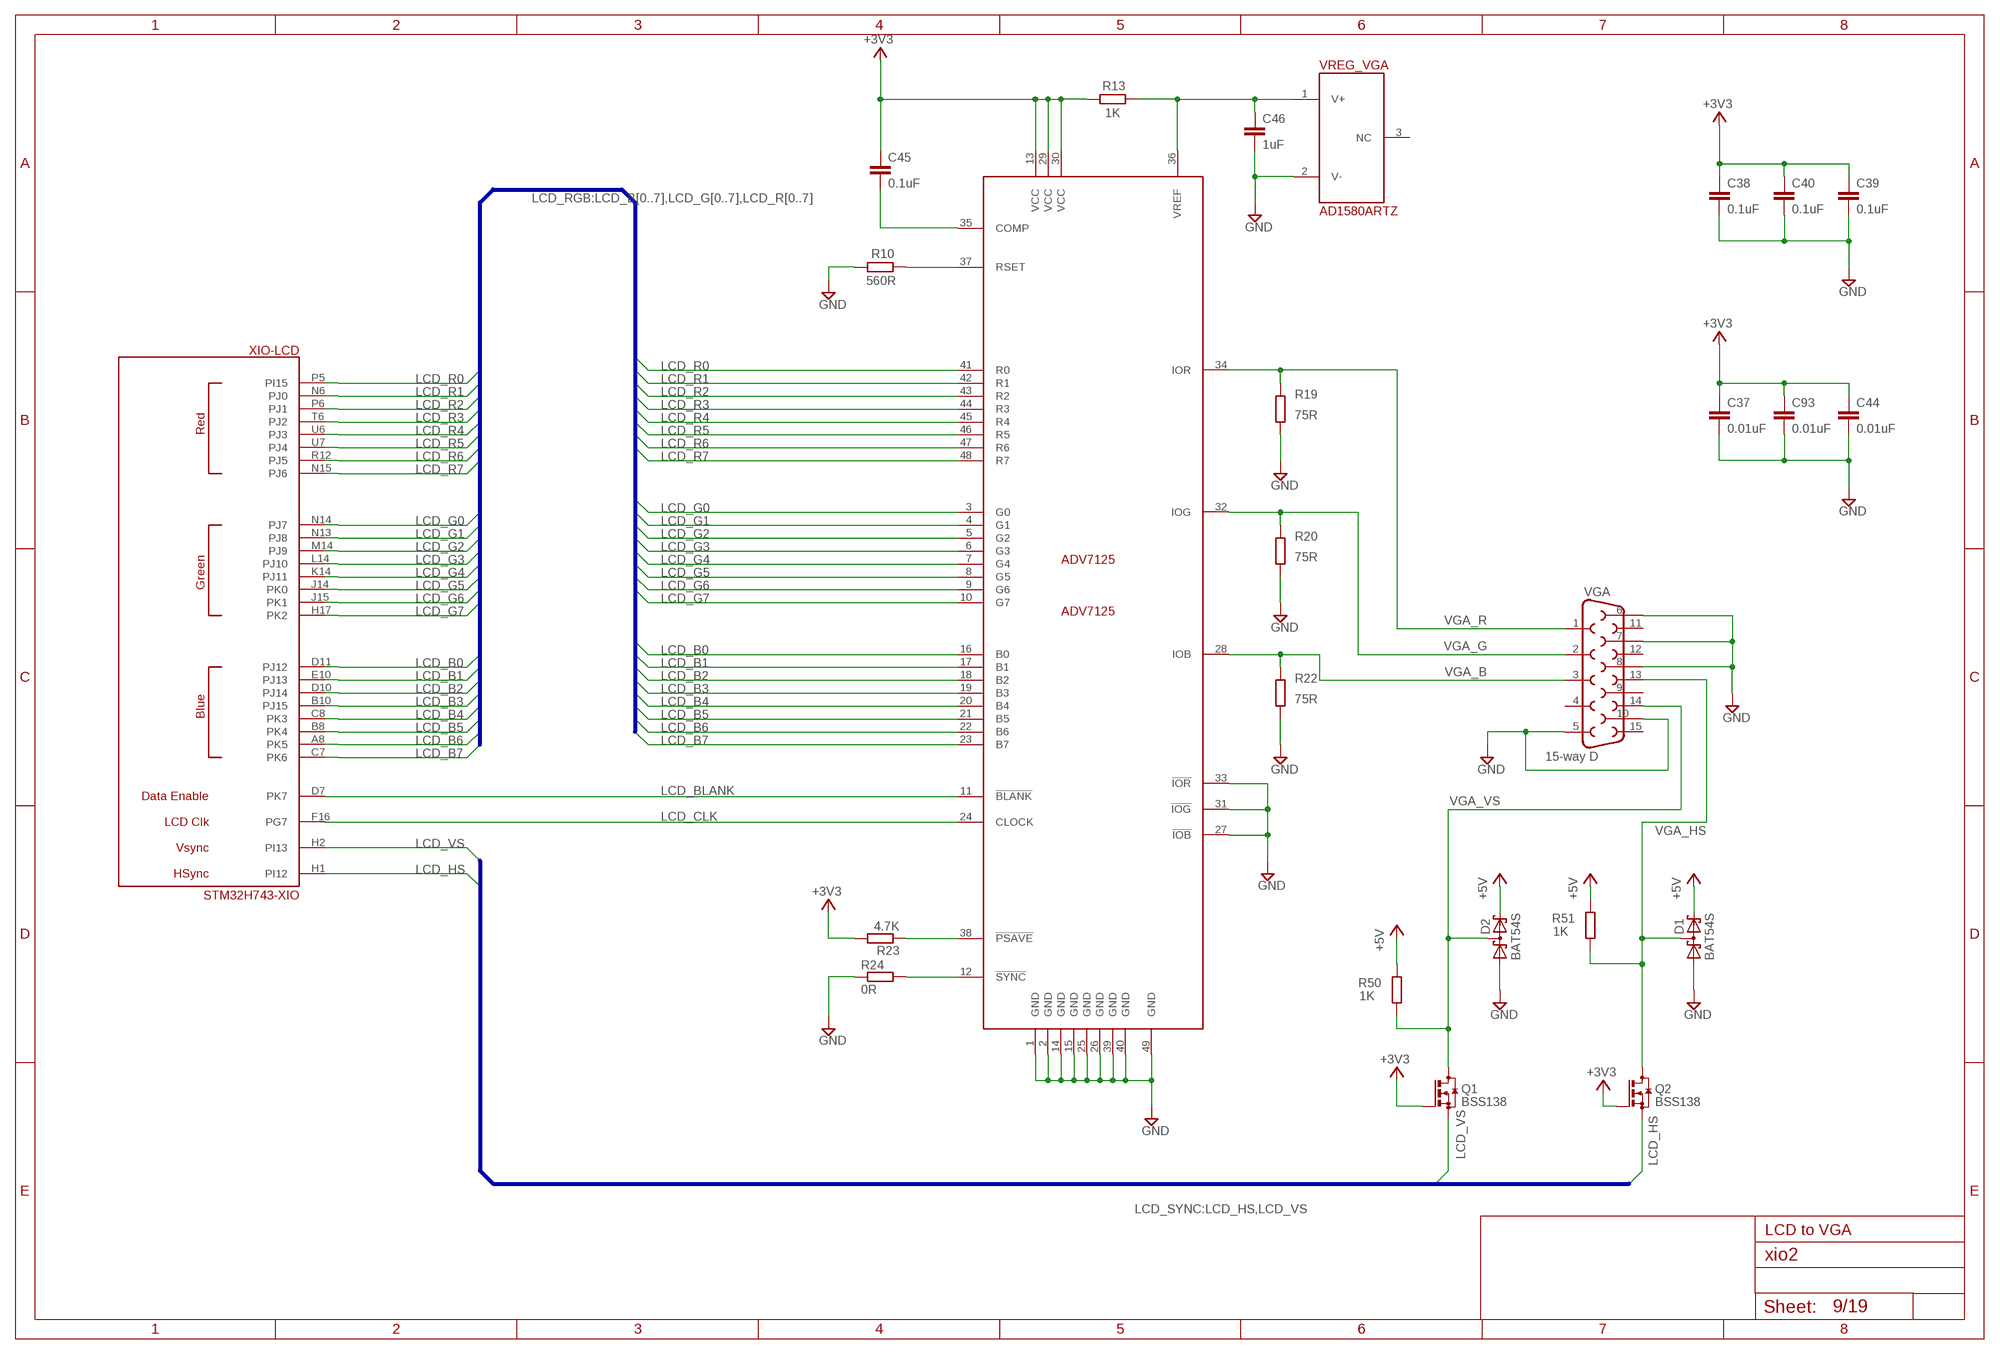
[diagram p8: schematic, sheet 9]

### Parts
ADV7125  ADV7125  [QFN50P700X700X100-49T495]
C37  0.01uF  C-EUC0201  [C0201]
C38  0.1uF  C-EUC0201  [C0201]
C39  0.1uF  C-EUC0201  [C0201]
C40  0.1uF  C-EUC0201  [C0201]
C44  0.01uF  C-EUC0201  [C0201]
C45  0.1uF  C-EUC0201  [C0201]
C46  1uF  C-EUC0201  [C0201]
C93  0.01uF  C-EUC0201  [C0201]
D1  BAT54S  [SOT23]
D2  BAT54S  [SOT23]
Q1  BSS138  BSS123  [SOT23]
Q2  BSS138  BSS123  [SOT23]
R10  560R  R-EU_R0201  [R0201]
R13  1K  R-EU_R0201  [R0201]
R19  75R  R-EU_R0201  [R0201]
R20  75R  R-EU_R0201  [R0201]
R22  75R  R-EU_R0201  [R0201]
R23  4.7K  R-EU_R0201  [R0201]
R24  0R  R-EU_R0201  [R0201]
R50  1K  R-EU_R0201  [R0201]
R51  1K  R-EU_R0201  [R0201]
VGA  15-way D  DB15  [DB15]
VREG_VGA  AD1580ARTZ  [SOT23]

### Nets
+3V3 [lcd]: ADV7125.13(VCC) ADV7125.29(VCC) ADV7125.30(VCC) C37.1 C38.1 C39.1 C40.1 C44.1 C45.1 C93.1 Q1.1(G) Q2.1(G) R13.2 R23.2 ; also sheet 2,4,5,6,7,10,11,12,13,14,15,16,17,18,19
+5V [Power]: D1.2(C2) D2.2(C2) R50.1 R51.1 ; also sheet 2,7,8,10,11,12,13,18,19
GND: ADV7125.1(GND) ADV7125.2(GND) ADV7125.14(GND) ADV7125.15(GND) ADV7125.25(GND) ADV7125.26(GND) ADV7125.27(!IOB!) ADV7125.31(!IOG!) ADV7125.33(!IOR!) ADV7125.39(GND) ADV7125.40(GND) ADV7125.49(GND) C37.2 C38.2 C39.2 C40.2 C44.2 C46.2 C93.2 D1.1(A1) D2.1(A1) R10.1 R19.2 R20.2 R22.2 R24.1 VGA.5 VGA.6 VGA.7 VGA.8 VGA.10 VREG_VGA.2(V-) ; also sheet 2,4,5,6,7,8,10,11,12,13,14,15,16,17,18,19
LCD_B0 [lcd]: ADV7125.16(B0) XIO.D11(-LCD:PJ12)
LCD_B1 [lcd]: ADV7125.17(B1) XIO.E10(-LCD:PJ13)
LCD_B2 [lcd]: ADV7125.18(B2) XIO.D10(-LCD:PJ14)
LCD_B3 [lcd]: ADV7125.19(B3) XIO.B10(-LCD:PJ15)
LCD_B4 [lcd]: ADV7125.20(B4) XIO.C8(-LCD:PK3)
LCD_B5 [lcd]: ADV7125.21(B5) XIO.B8(-LCD:PK4)
LCD_B6 [lcd]: ADV7125.22(B6) XIO.A8(-LCD:PK5)
LCD_B7 [lcd]: ADV7125.23(B7) XIO.C7(-LCD:PK6)
LCD_BLANK: ADV7125.11(!BLANK!) XIO.D7(-LCD:PK7)
LCD_CLK: ADV7125.24(CLOCK) XIO.F16(-LCD:PG7)
LCD_G0 [lcd]: ADV7125.3(G0) XIO.N14(-LCD:PJ7)
LCD_G1 [lcd]: ADV7125.4(G1) XIO.N13(-LCD:PJ8)
LCD_G2 [lcd]: ADV7125.5(G2) XIO.M14(-LCD:PJ9)
LCD_G3 [lcd]: ADV7125.6(G3) XIO.L14(-LCD:PJ10)
LCD_G4 [lcd]: ADV7125.7(G4) XIO.K14(-LCD:PJ11)
LCD_G5 [lcd]: ADV7125.8(G5) XIO.J14(-LCD:PK0)
LCD_G6 [lcd]: ADV7125.9(G6) XIO.J15(-LCD:PK1)
LCD_G7 [lcd]: ADV7125.10(G7) XIO.H17(-LCD:PK2)
LCD_HS [lcd]: Q2.2(S) XIO.H1(-LCD:PI12)
LCD_R0 [lcd]: ADV7125.41(R0) XIO.P5(-LCD:PI15)
LCD_R1 [lcd]: ADV7125.42(R1) XIO.N6(-LCD:PJ0)
LCD_R2 [lcd]: ADV7125.43(R2) XIO.P6(-LCD:PJ1)
LCD_R3 [lcd]: ADV7125.44(R3) XIO.T6(-LCD:PJ2)
LCD_R4 [lcd]: ADV7125.45(R4) XIO.U6(-LCD:PJ3)
LCD_R5 [lcd]: ADV7125.46(R5) XIO.U7(-LCD:PJ4)
LCD_R6 [lcd]: ADV7125.47(R6) XIO.R12(-LCD:PJ5)
LCD_R7 [lcd]: ADV7125.48(R7) XIO.N15(-LCD:PJ6)
LCD_VS [lcd]: Q1.2(S) XIO.H2(-LCD:PI13)
N$6: ADV7125.36(VREF) C46.1 R13.1 VREG_VGA.1(V+)
N$8: ADV7125.35(COMP) C45.2
N$10: ADV7125.38(!PSAVE!) R23.1
N$17: ADV7125.37(RSET) R10.2
N$18: ADV7125.12(!SYNC!) R24.2
VGA_B: ADV7125.28(IOB) R22.1 VGA.3
VGA_G: ADV7125.32(IOG) R20.1 VGA.2
VGA_HS [lcd]: D1.3(C1A2) Q2.3(D) R51.2 VGA.13
VGA_R [lcd]: ADV7125.34(IOR) R19.1 VGA.1
VGA_VS [lcd]: D2.3(C1A2) Q1.3(D) R50.2 VGA.14
Unconnected: VGA.4 VGA.9 VGA.11 VGA.12 VGA.15 VREG_VGA.3(NC)

### Buses
LCD_RGB:LCD_B[0..7],LCD_G[0..7],LCD_R[0..7]
LCD_SYNC:LCD_HS,LCD_VS

### Notes on the sheet
- LCD to VGA

## Sheet 10 of 19: Expansion slots 0 & 1
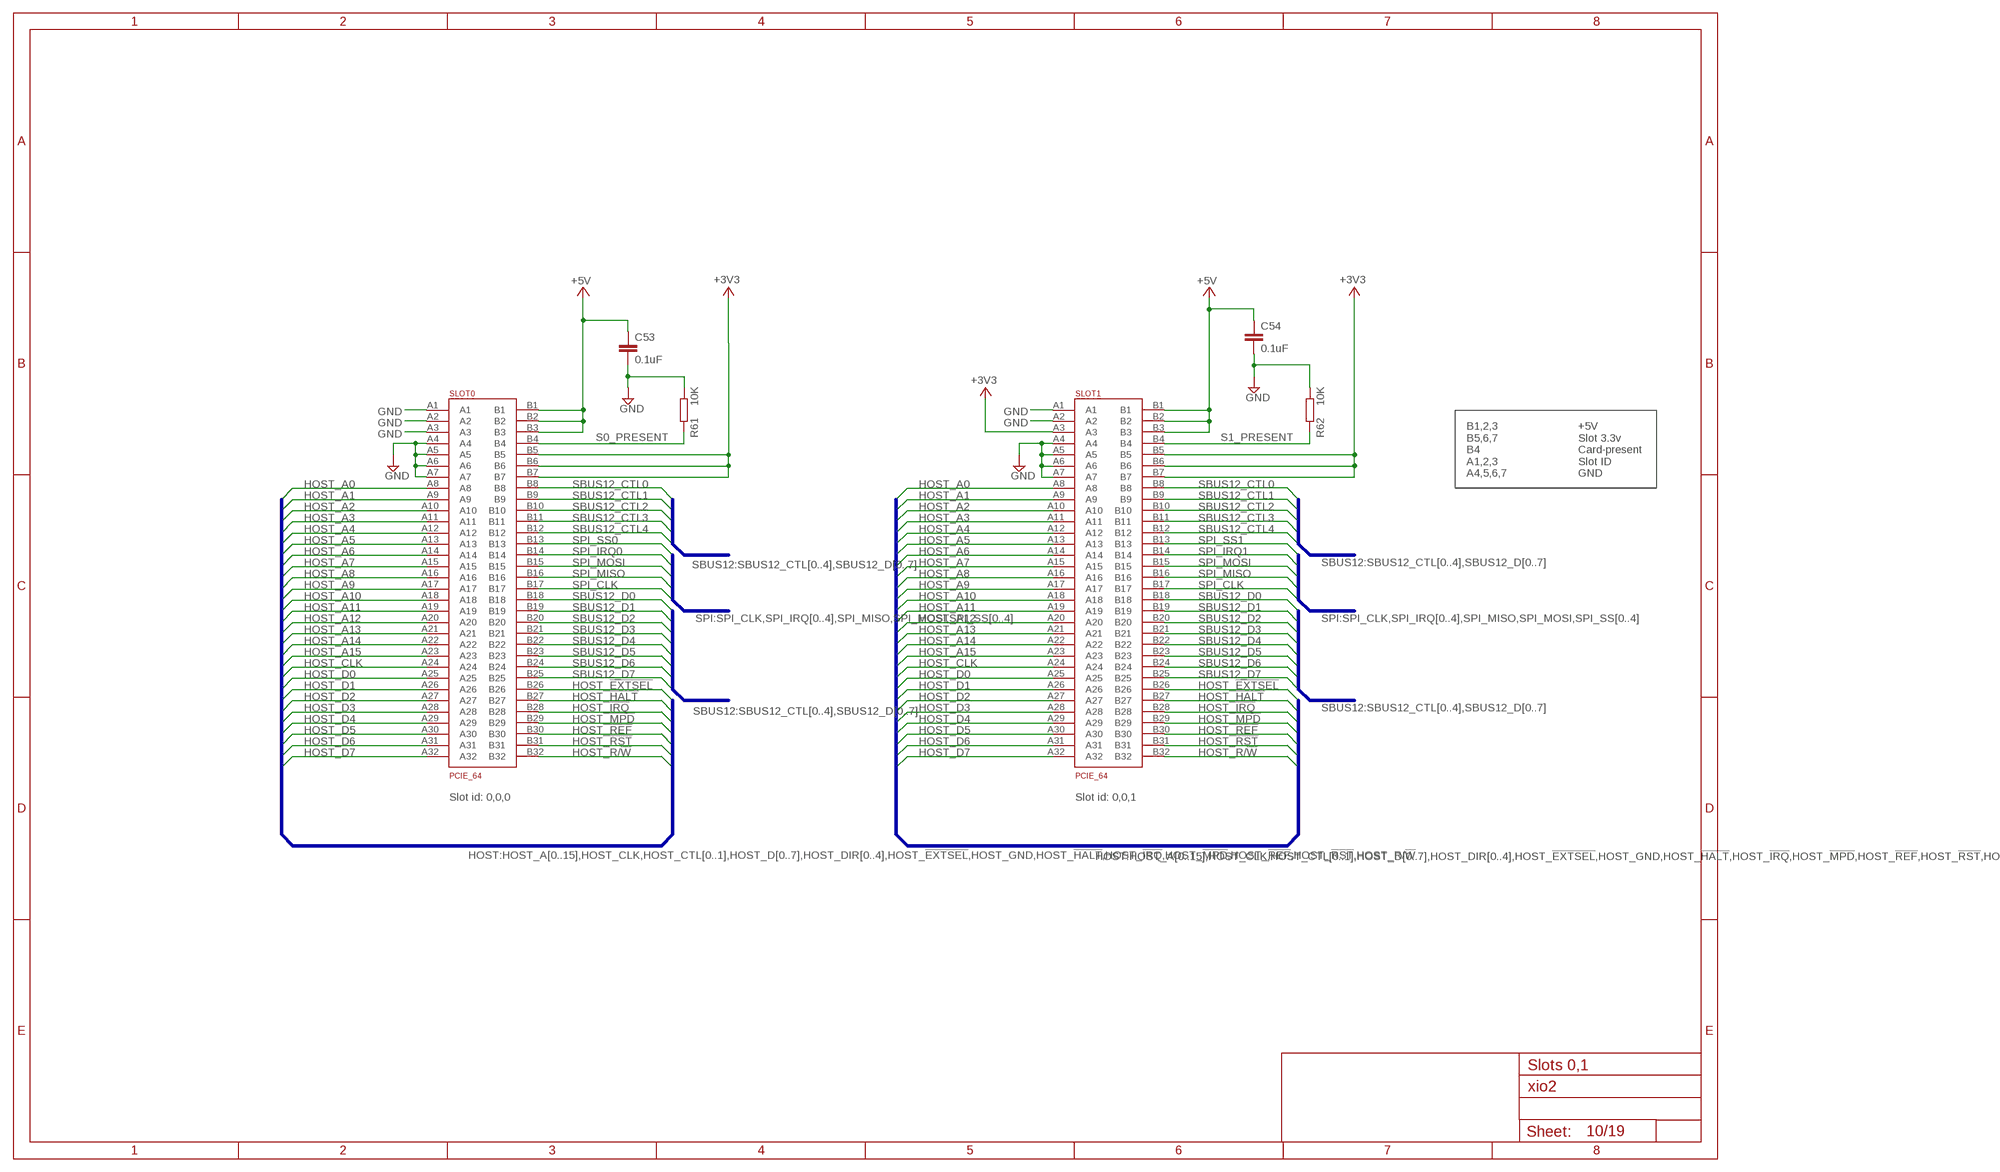
[diagram p9: schematic, sheet 10]

### Parts
C53  0.1uF  C-EUC0201  [C0201]
C54  0.1uF  C-EUC0201  [C0201]
R61  10K  R-EU_R0201  [R0201]
R62  10K  R-EU_R0201  [R0201]
SLOT0  PCIE_64  [PCI-E_64]
SLOT1  PCIE_64  [PCI-E_64]

### Nets
+3V3 [lcd]: SLOT0.B5 SLOT0.B6 SLOT0.B7 SLOT1.A3 SLOT1.B5 SLOT1.B6 SLOT1.B7 ; also sheet 2,4,5,6,7,9,11,12,13,14,15,16,17,18,19
+5V [Power]: C53.1 C54.1 SLOT0.B1 SLOT0.B2 SLOT0.B3 SLOT1.B1 SLOT1.B2 SLOT1.B3 ; also sheet 2,7,8,9,11,12,13,18,19
GND: C53.2 C54.2 R61.1 R62.1 SLOT0.A1 SLOT0.A2 SLOT0.A3 SLOT0.A4 SLOT0.A5 SLOT0.A6 SLOT0.A7 SLOT1.A1 SLOT1.A2 SLOT1.A4 SLOT1.A5 SLOT1.A6 SLOT1.A7 ; also sheet 2,4,5,6,7,8,9,11,12,13,14,15,16,17,18,19
HOST_!EXTSEL!: SLOT0.B26 SLOT1.B26 ; also sheet 11,12,16
HOST_!HALT!: SLOT0.B27 SLOT1.B27 ; also sheet 11,12,16
HOST_!IRQ!: SLOT0.B28 SLOT1.B28 ; also sheet 11,12,16
HOST_!MPD!: SLOT0.B29 SLOT1.B29 ; also sheet 11,12,16
HOST_!REF!: SLOT0.B30 SLOT1.B30 ; also sheet 11,12,16
HOST_!RST!: SLOT0.B31 SLOT1.B31 ; also sheet 11,12,16
HOST_A0: SLOT0.A8 SLOT1.A8 ; also sheet 3,11,12,16,18
HOST_A1: SLOT0.A9 SLOT1.A9 ; also sheet 3,11,12,16,18
HOST_A2: SLOT0.A10 SLOT1.A10 ; also sheet 3,11,12,16,18
HOST_A3: SLOT0.A11 SLOT1.A11 ; also sheet 3,11,12,16,18
HOST_A4: SLOT0.A12 SLOT1.A12 ; also sheet 3,11,12,16,18
HOST_A5: SLOT0.A13 SLOT1.A13 ; also sheet 3,11,12,16,18
HOST_A6: SLOT0.A14 SLOT1.A14 ; also sheet 3,11,12,16,18
HOST_A7: SLOT0.A15 SLOT1.A15 ; also sheet 3,11,12,16,18
HOST_A8: SLOT0.A16 SLOT1.A16 ; also sheet 3,11,12,16,18
HOST_A9: SLOT0.A17 SLOT1.A17 ; also sheet 3,11,12,16,18
HOST_A10: SLOT0.A18 SLOT1.A18 ; also sheet 3,11,12,16,18
HOST_A11: SLOT0.A19 SLOT1.A19 ; also sheet 3,11,12,16,18
HOST_A12: SLOT0.A20 SLOT1.A20 ; also sheet 3,11,12,16,18
HOST_A13: SLOT0.A21 SLOT1.A21 ; also sheet 3,11,12,16
HOST_A14: SLOT0.A22 SLOT1.A22 ; also sheet 3,11,12,16
HOST_A15: SLOT0.A23 SLOT1.A23 ; also sheet 3,11,12,16
HOST_CLK: SLOT0.A24 SLOT1.A24 ; also sheet 11,12,16,18
HOST_D0: SLOT0.A25 SLOT1.A25 ; also sheet 11,12,16,18
HOST_D1: SLOT0.A26 SLOT1.A26 ; also sheet 11,12,16,18
HOST_D2: SLOT0.A27 SLOT1.A27 ; also sheet 11,12,16,18
HOST_D3: SLOT0.A28 SLOT1.A28 ; also sheet 11,12,16,18
HOST_D4: SLOT0.A29 SLOT1.A29 ; also sheet 11,12,16,18
HOST_D5: SLOT0.A30 SLOT1.A30 ; also sheet 11,12,16,18
HOST_D6: SLOT0.A31 SLOT1.A31 ; also sheet 11,12,16,18
HOST_D7: SLOT0.A32 SLOT1.A32 ; also sheet 11,12,16,18
HOST_R/!W!: SLOT0.B32 SLOT1.B32 ; also sheet 11,12,16,18
S0_PRESENT: R61.2 SLOT0.B4 ; also sheet 6,19
S1_PRESENT: R62.2 SLOT1.B4 ; also sheet 6,19
SBUS12_CTL0: SLOT0.B8 SLOT1.B8
SBUS12_CTL1: SLOT0.B9 SLOT1.B9
SBUS12_CTL2: SLOT0.B10 SLOT1.B10
SBUS12_CTL3: SLOT0.B11 SLOT1.B11
SBUS12_CTL4: SLOT0.B12 SLOT1.B12
SBUS12_D0: SLOT0.B18 SLOT1.B18
SBUS12_D1: SLOT0.B19 SLOT1.B19
SBUS12_D2: SLOT0.B20 SLOT1.B20
SBUS12_D3: SLOT0.B21 SLOT1.B21
SBUS12_D4: SLOT0.B22 SLOT1.B22
SBUS12_D5: SLOT0.B23 SLOT1.B23
SBUS12_D6: SLOT0.B24 SLOT1.B24
SBUS12_D7: SLOT0.B25 SLOT1.B25
SPI_CLK [spi]: SLOT0.B17 SLOT1.B17 ; also sheet 3,6,11,12,15
SPI_IRQ0 [spi]: SLOT0.B14 ; also sheet 3,17
SPI_IRQ1 [spi]: SLOT1.B14 ; also sheet 3,17
SPI_MISO [spi]: SLOT0.B16 SLOT1.B16 ; also sheet 3,6,11,12,15
SPI_MOSI [spi]: SLOT0.B15 SLOT1.B15 ; also sheet 3,6,11,12,15
SPI_SS0 [spi]: SLOT0.B13 ; also sheet 3,19
SPI_SS1 [spi]: SLOT1.B13 ; also sheet 3,19

### Buses
SPI:SPI_CLK,SPI_IRQ[0..4],SPI_MISO,SPI_MOSI,SPI_SS[0..4]
HOST:HOST_A[0..15],HOST_CLK,HOST_CTL[0..1],HOST_D[0..7],HOST_DIR[0..4],HOST_!EXTSEL!,HOST_GND,HOST_!HALT!,HOST_!IRQ!,HOST_!MPD!,HOST_!REF!,HOST_!RST!,HOST_R/!W!
SBUS12:SBUS12_CTL[0..4],SBUS12_D[0..7]

### Notes on the sheet
- B1,2,3
  B5,6,7
  B4
  A1,2,3
  A4,5,6,7
- +5V
  Slot 3.3v
  Card-present
  Slot ID
  GND
- Slot id: 0,0,0 | Slot id: 0,0,1
- Slots 0,1

## Sheet 11 of 19: Expansion slots 2 & 3
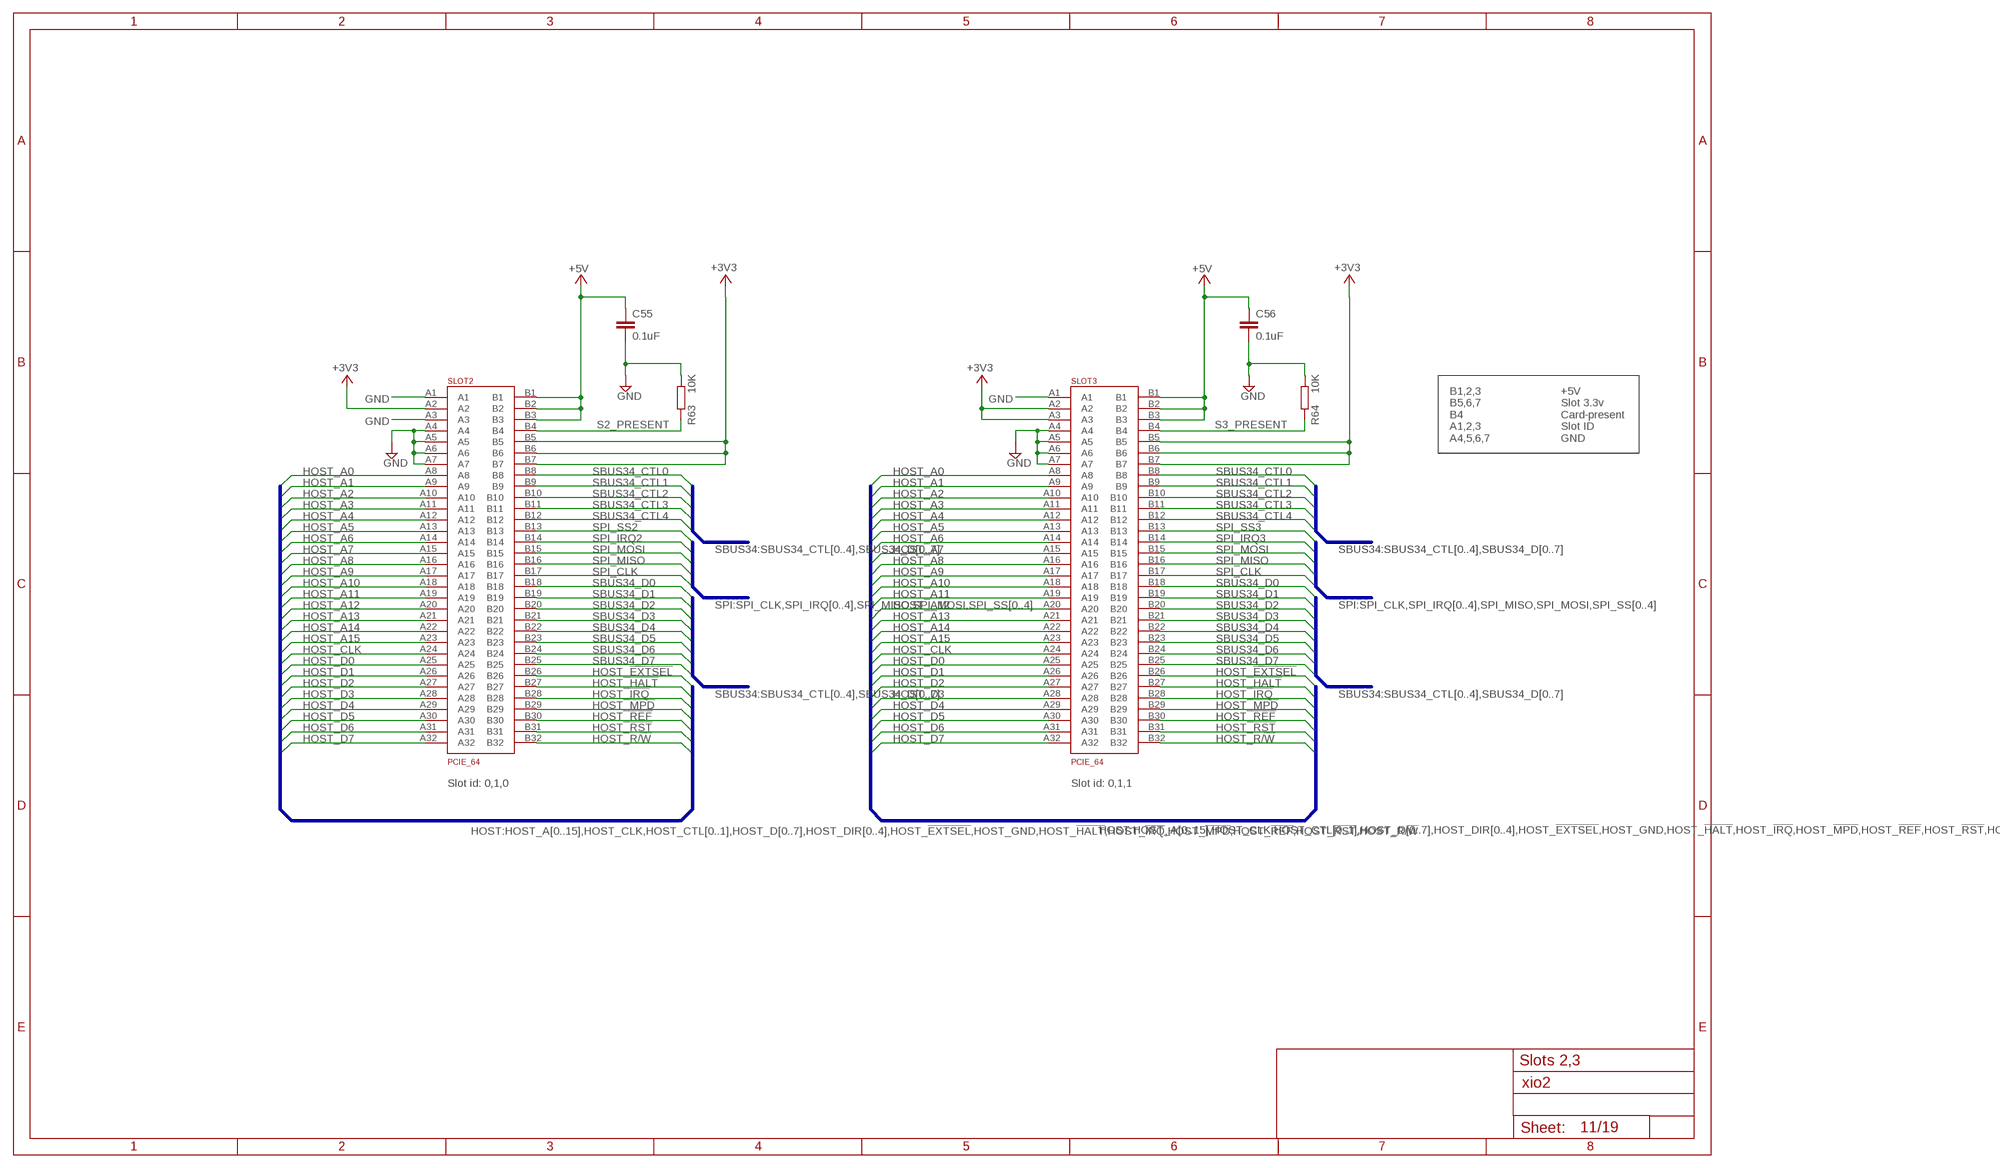
[diagram p10: schematic, sheet 11]

### Parts
C55  0.1uF  C-EUC0201  [C0201]
C56  0.1uF  C-EUC0201  [C0201]
R63  10K  R-EU_R0201  [R0201]
R64  10K  R-EU_R0201  [R0201]
SLOT2  PCIE_64  [PCI-E_64]
SLOT3  PCIE_64  [PCI-E_64]

### Nets
+3V3 [lcd]: SLOT2.A2 SLOT2.B5 SLOT2.B6 SLOT2.B7 SLOT3.A2 SLOT3.A3 SLOT3.B5 SLOT3.B6 SLOT3.B7 ; also sheet 2,4,5,6,7,9,10,12,13,14,15,16,17,18,19
+5V [Power]: C55.1 C56.1 SLOT2.B1 SLOT2.B2 SLOT2.B3 SLOT3.B1 SLOT3.B2 SLOT3.B3 ; also sheet 2,7,8,9,10,12,13,18,19
GND: C55.2 C56.2 R63.1 R64.1 SLOT2.A1 SLOT2.A3 SLOT2.A4 SLOT2.A5 SLOT2.A6 SLOT2.A7 SLOT3.A1 SLOT3.A4 SLOT3.A5 SLOT3.A6 SLOT3.A7 ; also sheet 2,4,5,6,7,8,9,10,12,13,14,15,16,17,18,19
HOST_!EXTSEL!: SLOT2.B26 SLOT3.B26 ; also sheet 10,12,16
HOST_!HALT!: SLOT2.B27 SLOT3.B27 ; also sheet 10,12,16
HOST_!IRQ!: SLOT2.B28 SLOT3.B28 ; also sheet 10,12,16
HOST_!MPD!: SLOT2.B29 SLOT3.B29 ; also sheet 10,12,16
HOST_!REF!: SLOT2.B30 SLOT3.B30 ; also sheet 10,12,16
HOST_!RST!: SLOT2.B31 SLOT3.B31 ; also sheet 10,12,16
HOST_A0: SLOT2.A8 SLOT3.A8 ; also sheet 3,10,12,16,18
HOST_A1: SLOT2.A9 SLOT3.A9 ; also sheet 3,10,12,16,18
HOST_A2: SLOT2.A10 SLOT3.A10 ; also sheet 3,10,12,16,18
HOST_A3: SLOT2.A11 SLOT3.A11 ; also sheet 3,10,12,16,18
HOST_A4: SLOT2.A12 SLOT3.A12 ; also sheet 3,10,12,16,18
HOST_A5: SLOT2.A13 SLOT3.A13 ; also sheet 3,10,12,16,18
HOST_A6: SLOT2.A14 SLOT3.A14 ; also sheet 3,10,12,16,18
HOST_A7: SLOT2.A15 SLOT3.A15 ; also sheet 3,10,12,16,18
HOST_A8: SLOT2.A16 SLOT3.A16 ; also sheet 3,10,12,16,18
HOST_A9: SLOT2.A17 SLOT3.A17 ; also sheet 3,10,12,16,18
HOST_A10: SLOT2.A18 SLOT3.A18 ; also sheet 3,10,12,16,18
HOST_A11: SLOT2.A19 SLOT3.A19 ; also sheet 3,10,12,16,18
HOST_A12: SLOT2.A20 SLOT3.A20 ; also sheet 3,10,12,16,18
HOST_A13: SLOT2.A21 SLOT3.A21 ; also sheet 3,10,12,16
HOST_A14: SLOT2.A22 SLOT3.A22 ; also sheet 3,10,12,16
HOST_A15: SLOT2.A23 SLOT3.A23 ; also sheet 3,10,12,16
HOST_CLK: SLOT2.A24 SLOT3.A24 ; also sheet 10,12,16,18
HOST_D0: SLOT2.A25 SLOT3.A25 ; also sheet 10,12,16,18
HOST_D1: SLOT2.A26 SLOT3.A26 ; also sheet 10,12,16,18
HOST_D2: SLOT2.A27 SLOT3.A27 ; also sheet 10,12,16,18
HOST_D3: SLOT2.A28 SLOT3.A28 ; also sheet 10,12,16,18
HOST_D4: SLOT2.A29 SLOT3.A29 ; also sheet 10,12,16,18
HOST_D5: SLOT2.A30 SLOT3.A30 ; also sheet 10,12,16,18
HOST_D6: SLOT2.A31 SLOT3.A31 ; also sheet 10,12,16,18
HOST_D7: SLOT2.A32 SLOT3.A32 ; also sheet 10,12,16,18
HOST_R/!W!: SLOT2.B32 SLOT3.B32 ; also sheet 10,12,16,18
S2_PRESENT: R63.2 SLOT2.B4 ; also sheet 6,19
S3_PRESENT: R64.2 SLOT3.B4 ; also sheet 6,19
SBUS34_CTL0: SLOT2.B8 SLOT3.B8
SBUS34_CTL1: SLOT2.B9 SLOT3.B9
SBUS34_CTL2: SLOT2.B10 SLOT3.B10
SBUS34_CTL3: SLOT2.B11 SLOT3.B11
SBUS34_CTL4: SLOT2.B12 SLOT3.B12
SBUS34_D0: SLOT2.B18 SLOT3.B18
SBUS34_D1: SLOT2.B19 SLOT3.B19
SBUS34_D2: SLOT2.B20 SLOT3.B20
SBUS34_D3: SLOT2.B21 SLOT3.B21
SBUS34_D4: SLOT2.B22 SLOT3.B22
SBUS34_D5: SLOT2.B23 SLOT3.B23
SBUS34_D6: SLOT2.B24 SLOT3.B24
SBUS34_D7: SLOT2.B25 SLOT3.B25
SPI_CLK [spi]: SLOT2.B17 SLOT3.B17 ; also sheet 3,6,10,12,15
SPI_IRQ2 [spi]: SLOT2.B14 ; also sheet 3,17
SPI_IRQ3 [spi]: SLOT3.B14 ; also sheet 3,17
SPI_MISO [spi]: SLOT2.B16 SLOT3.B16 ; also sheet 3,6,10,12,15
SPI_MOSI [spi]: SLOT2.B15 SLOT3.B15 ; also sheet 3,6,10,12,15
SPI_SS2 [spi]: SLOT2.B13 ; also sheet 3,19
SPI_SS3 [spi]: SLOT3.B13 ; also sheet 3,19

### Buses
SPI:SPI_CLK,SPI_IRQ[0..4],SPI_MISO,SPI_MOSI,SPI_SS[0..4]
HOST:HOST_A[0..15],HOST_CLK,HOST_CTL[0..1],HOST_D[0..7],HOST_DIR[0..4],HOST_!EXTSEL!,HOST_GND,HOST_!HALT!,HOST_!IRQ!,HOST_!MPD!,HOST_!REF!,HOST_!RST!,HOST_R/!W!
SBUS34:SBUS34_CTL[0..4],SBUS34_D[0..7]

### Notes on the sheet
- B1,2,3
  B5,6,7
  B4
  A1,2,3
  A4,5,6,7
- +5V
  Slot 3.3v
  Card-present
  Slot ID
  GND
- Slot id: 0,1,0 | Slot id: 0,1,1
- Slots 2,3

## Sheet 12 of 19: Expansion slots 4 & 5
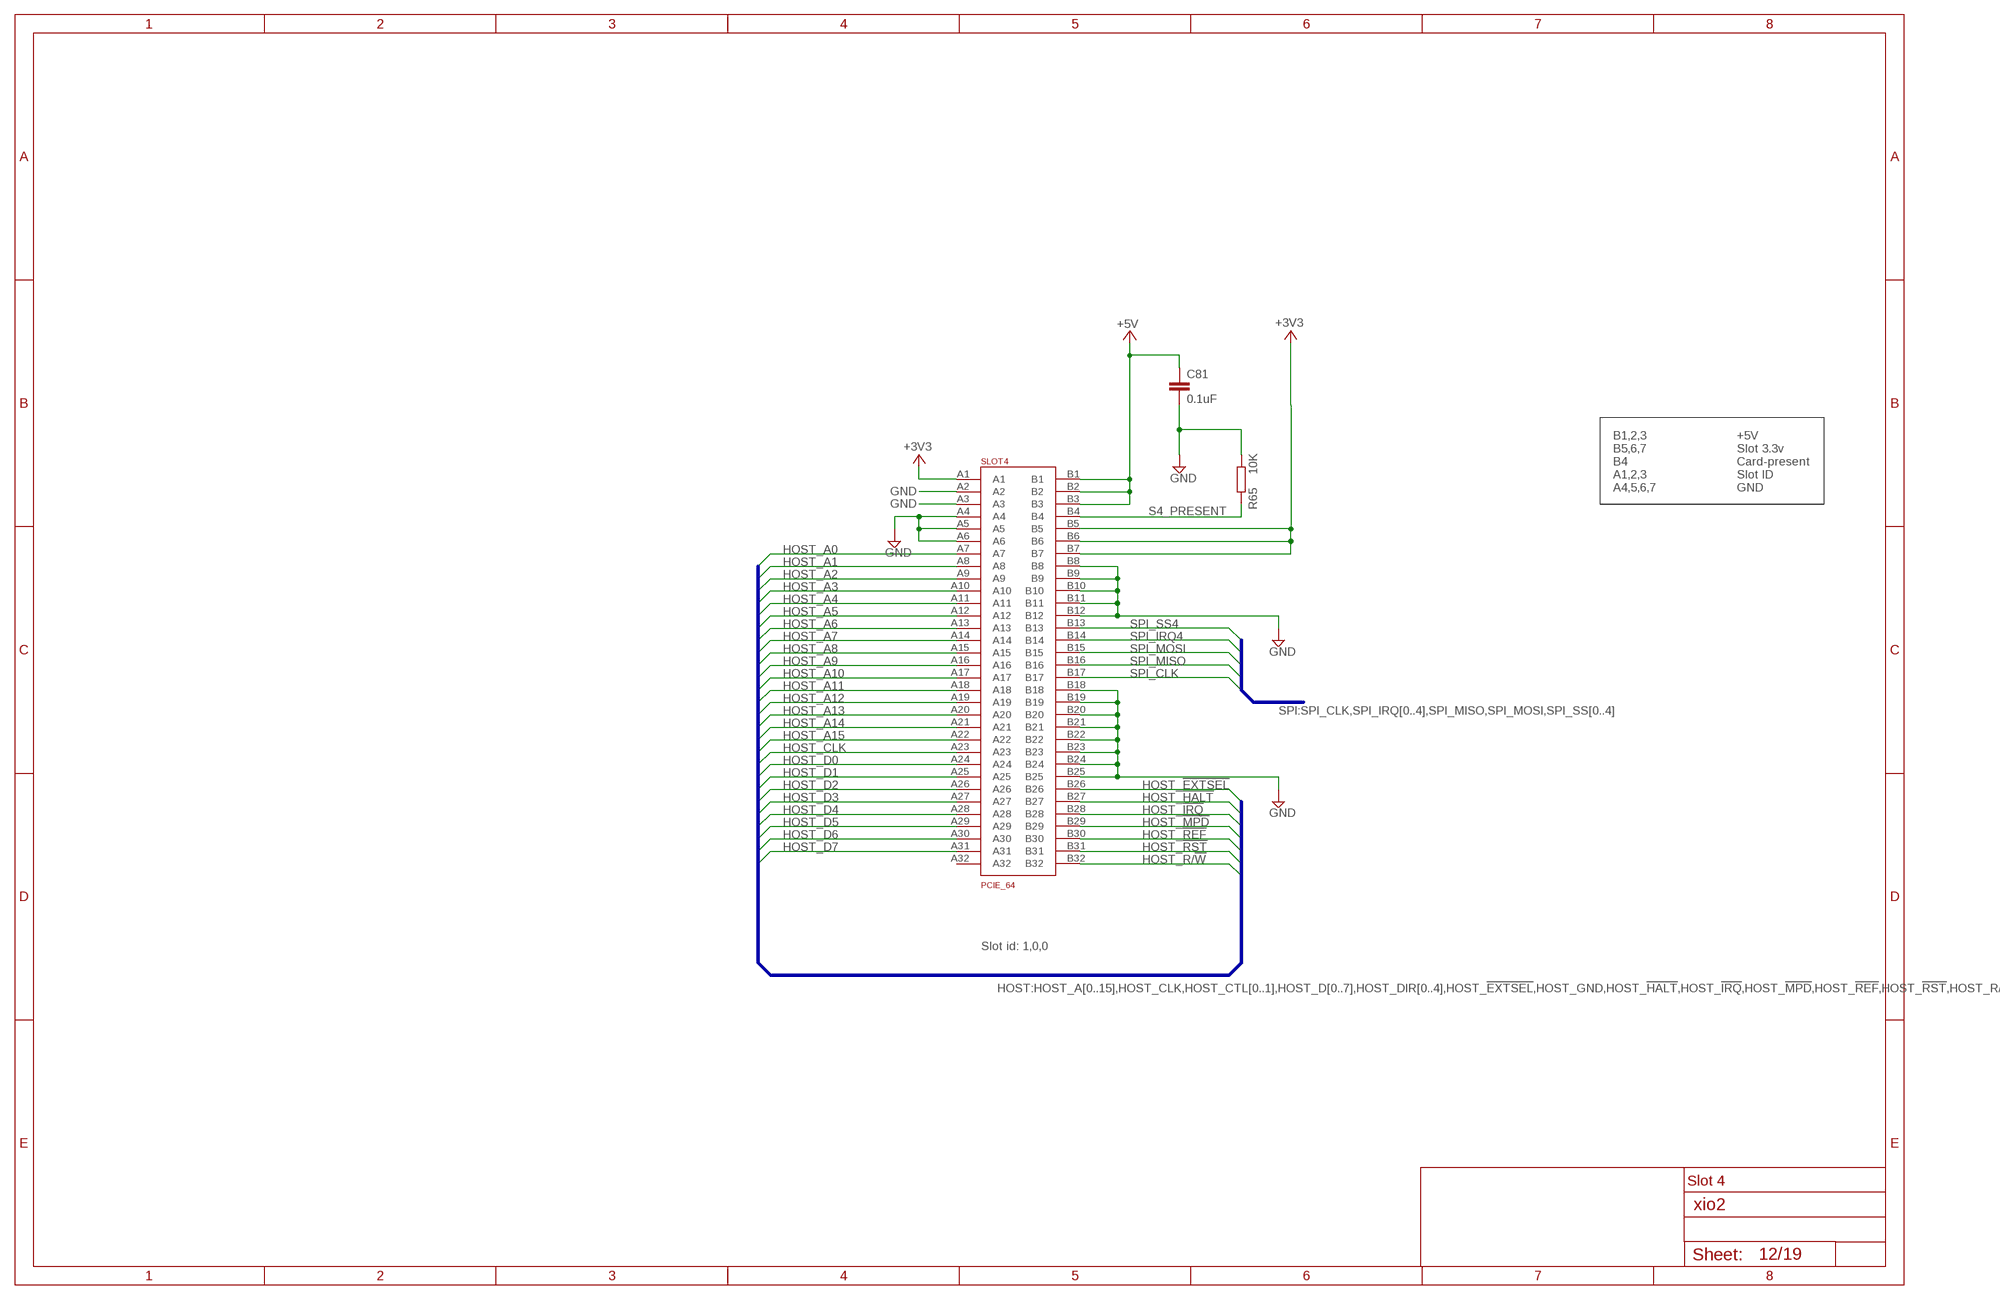
[diagram p11: schematic, sheet 12]

### Parts
C81  0.1uF  C-EUC0201  [C0201]
R65  10K  R-EU_R0201  [R0201]
SLOT4  PCIE_64  [PCI-E_64]

### Nets
+3V3 [lcd]: SLOT4.A1 SLOT4.B5 SLOT4.B6 SLOT4.B7 ; also sheet 2,4,5,6,7,9,10,11,13,14,15,16,17,18,19
+5V [Power]: C81.1 SLOT4.B1 SLOT4.B2 SLOT4.B3 ; also sheet 2,7,8,9,10,11,13,18,19
GND: C81.2 R65.1 SLOT4.A2 SLOT4.A3 SLOT4.A4 SLOT4.A5 SLOT4.A6 SLOT4.B8 SLOT4.B9 SLOT4.B10 SLOT4.B11 SLOT4.B12 SLOT4.B18 SLOT4.B19 SLOT4.B20 SLOT4.B21 SLOT4.B22 SLOT4.B23 SLOT4.B24 SLOT4.B25 ; also sheet 2,4,5,6,7,8,9,10,11,13,14,15,16,17,18,19
HOST_!EXTSEL!: SLOT4.B26 ; also sheet 10,11,16
HOST_!HALT!: SLOT4.B27 ; also sheet 10,11,16
HOST_!IRQ!: SLOT4.B28 ; also sheet 10,11,16
HOST_!MPD!: SLOT4.B29 ; also sheet 10,11,16
HOST_!REF!: SLOT4.B30 ; also sheet 10,11,16
HOST_!RST!: SLOT4.B31 ; also sheet 10,11,16
HOST_A0: SLOT4.A7 ; also sheet 3,10,11,16,18
HOST_A1: SLOT4.A8 ; also sheet 3,10,11,16,18
HOST_A2: SLOT4.A9 ; also sheet 3,10,11,16,18
HOST_A3: SLOT4.A10 ; also sheet 3,10,11,16,18
HOST_A4: SLOT4.A11 ; also sheet 3,10,11,16,18
HOST_A5: SLOT4.A12 ; also sheet 3,10,11,16,18
HOST_A6: SLOT4.A13 ; also sheet 3,10,11,16,18
HOST_A7: SLOT4.A14 ; also sheet 3,10,11,16,18
HOST_A8: SLOT4.A15 ; also sheet 3,10,11,16,18
HOST_A9: SLOT4.A16 ; also sheet 3,10,11,16,18
HOST_A10: SLOT4.A17 ; also sheet 3,10,11,16,18
HOST_A11: SLOT4.A18 ; also sheet 3,10,11,16,18
HOST_A12: SLOT4.A19 ; also sheet 3,10,11,16,18
HOST_A13: SLOT4.A20 ; also sheet 3,10,11,16
HOST_A14: SLOT4.A21 ; also sheet 3,10,11,16
HOST_A15: SLOT4.A22 ; also sheet 3,10,11,16
HOST_CLK: SLOT4.A23 ; also sheet 10,11,16,18
HOST_D0: SLOT4.A24 ; also sheet 10,11,16,18
HOST_D1: SLOT4.A25 ; also sheet 10,11,16,18
HOST_D2: SLOT4.A26 ; also sheet 10,11,16,18
HOST_D3: SLOT4.A27 ; also sheet 10,11,16,18
HOST_D4: SLOT4.A28 ; also sheet 10,11,16,18
HOST_D5: SLOT4.A29 ; also sheet 10,11,16,18
HOST_D6: SLOT4.A30 ; also sheet 10,11,16,18
HOST_D7: SLOT4.A31 ; also sheet 10,11,16,18
HOST_R/!W!: SLOT4.B32 ; also sheet 10,11,16,18
S4_PRESENT: R65.2 SLOT4.B4 ; also sheet 6,19
SPI_CLK [spi]: SLOT4.B17 ; also sheet 3,6,10,11,15
SPI_IRQ4 [spi]: SLOT4.B14 ; also sheet 3,17
SPI_MISO [spi]: SLOT4.B16 ; also sheet 3,6,10,11,15
SPI_MOSI [spi]: SLOT4.B15 ; also sheet 3,6,10,11,15
SPI_SS4 [spi]: SLOT4.B13 ; also sheet 3,19
Unconnected: SLOT4.A32

### Buses
SPI:SPI_CLK,SPI_IRQ[0..4],SPI_MISO,SPI_MOSI,SPI_SS[0..4]
HOST:HOST_A[0..15],HOST_CLK,HOST_CTL[0..1],HOST_D[0..7],HOST_DIR[0..4],HOST_!EXTSEL!,HOST_GND,HOST_!HALT!,HOST_!IRQ!,HOST_!MPD!,HOST_!REF!,HOST_!RST!,HOST_R/!W!

### Notes on the sheet
- B1,2,3
  B5,6,7
  B4
  A1,2,3
  A4,5,6,7
- +5V
  Slot 3.3v
  Card-present
  Slot ID
  GND
- Slot id: 1,0,0
- Slot 4

## Sheet 13 of 19: FPGA power supplies
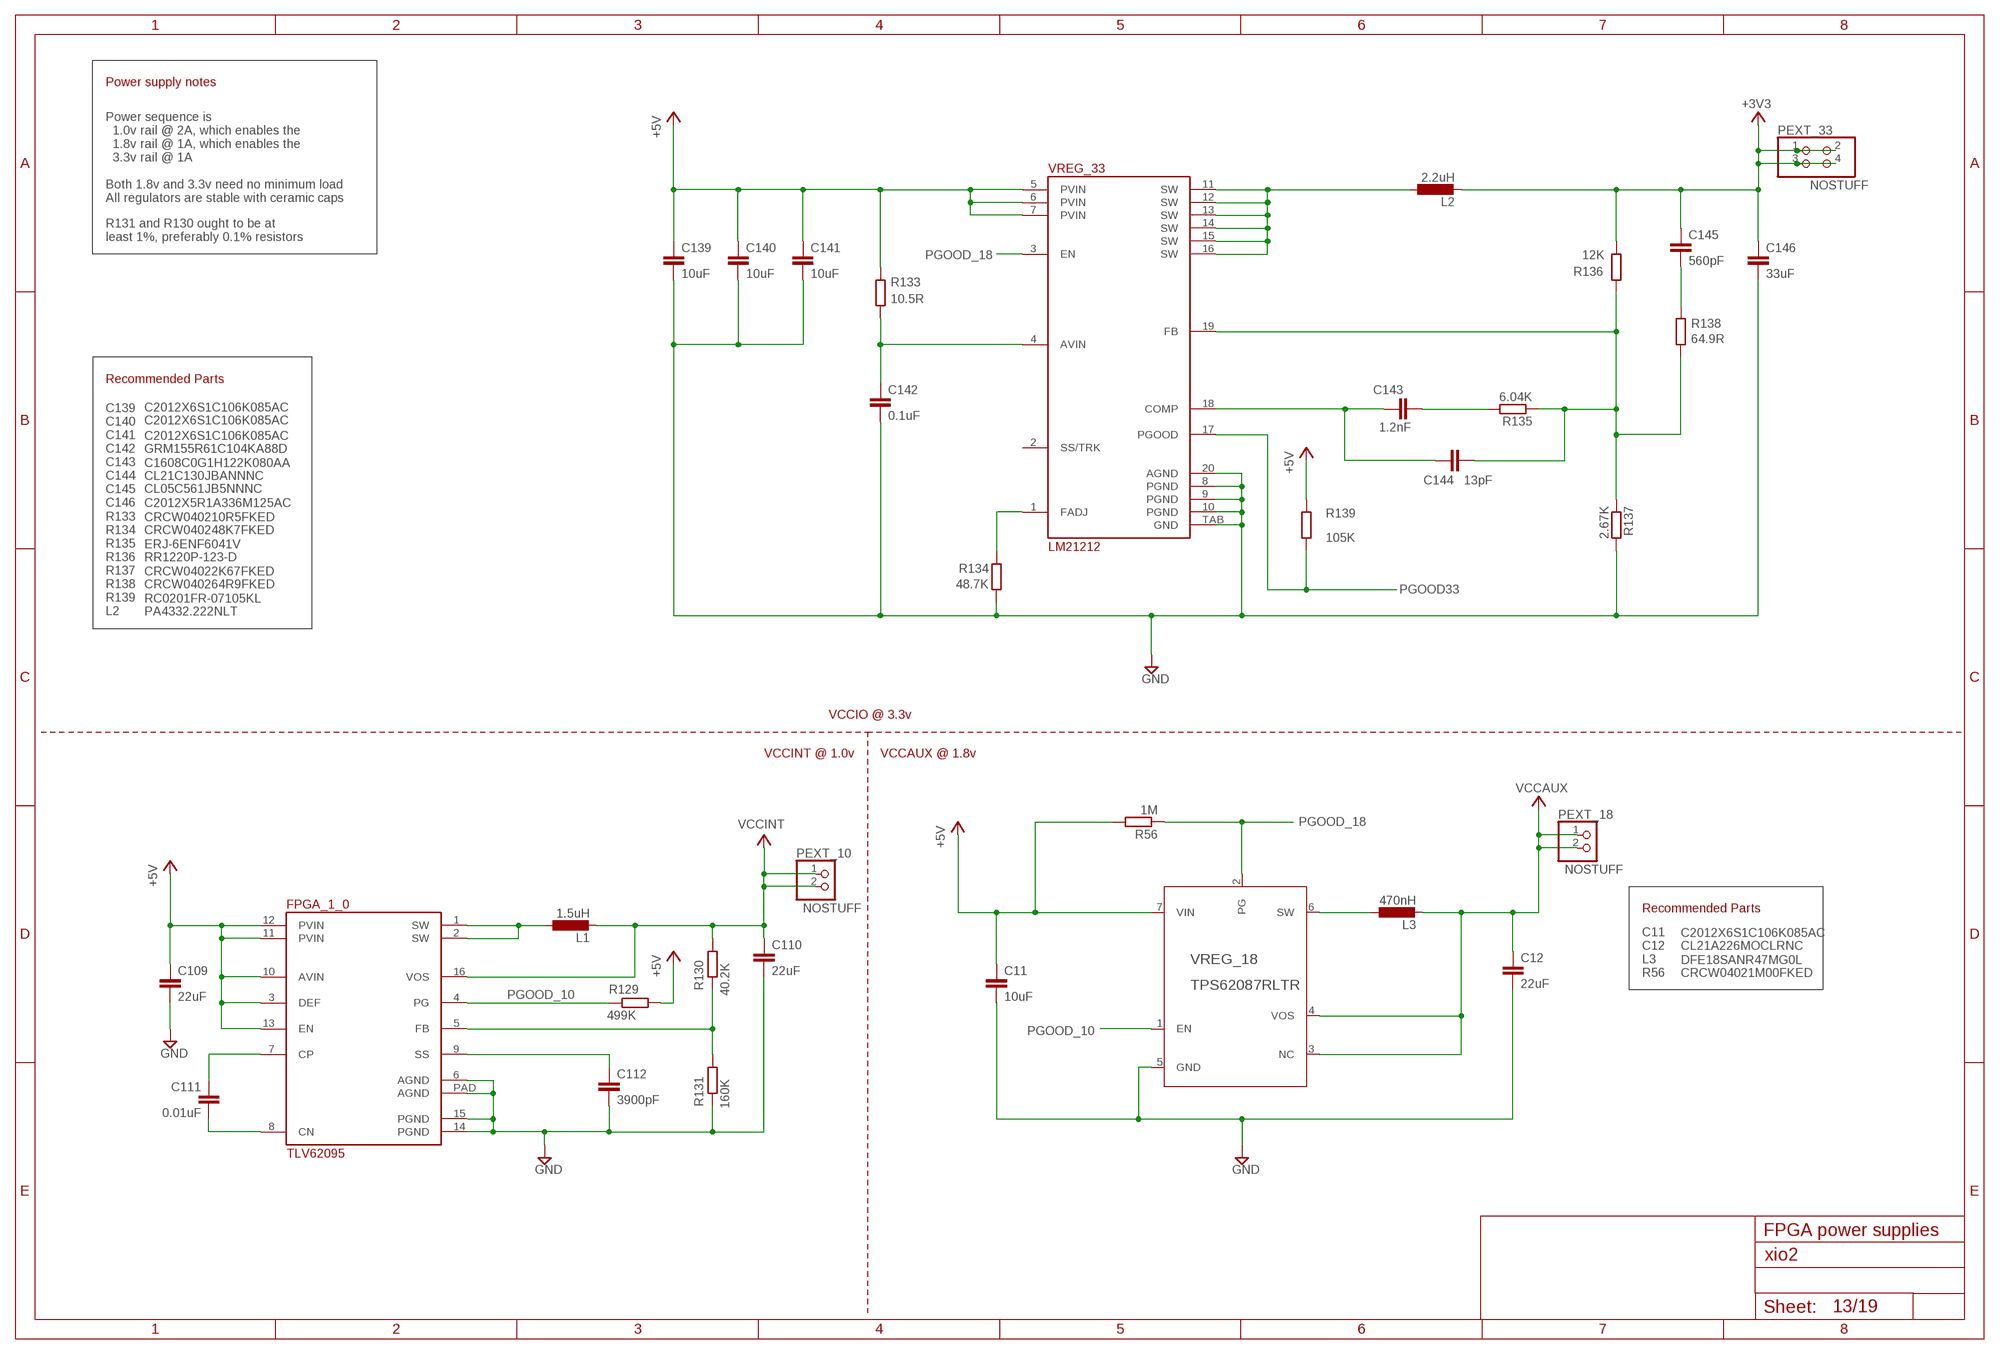
[diagram p12: schematic, sheet 13]

### Parts
C11  10uF  C-EUC0805  [C0805]
C12  22uF  C-EUC2012  [C2012]
C109  22uF  C-EUC0805  [C0805]
C110  22uF  C-EUC0805  [C0805]
C111  0.01uF  C-EUC0402  [C0402]
C112  3900pF  C-EUC0402  [C0402]
C139  10uF  C-EUC0805  [C0805]
C140  10uF  C-EUC0805  [C0805]
C141  10uF  C-EUC0805  [C0805]
C142  0.1uF  C-EUC0402  [C0402]
C143  1.2nF  C-EUC0603  [C0603]
C144  13pF  C-EUC0805  [C0805]
C145  560pF  C-EUC0402  [C0402]
C146  33uF  C-EUC0805  [C0805]
FPGA_1_0  TLV62095  [QFN50P310X310X100-16]
L1  1.5uH  L-EUL5650M  [L5650M]
L2  2.2uH  PA4332  [RESC4137X200]
L3  470nH  DFE18SANR47MG0L  [L0603]
PEXT_10  PINHD-1X2  [1X02]
PEXT_18  PINHD-1X2  [1X02]
PEXT_33  PINHD-2X2  [2X02]
R56  1M  R-EU_R0402  [R0402]
R129  499K  R-EU_R0402  [R0402]
R130  40.2K  R-EU_R0402  [R0402]
R131  160K  R-EU_R0402  [R0402]
R133  10.5R  R-EU_R0402  [R0402]
R134  48.7K  R-EU_R0402  [R0402]
R135  6.04K  R-EU_R0805  [R0805]
R136  12K  R-EU_R0805  [R0805]
R137  2.67K  R-EU_R0402  [R0402]
R138  64.9R  R-EU_R0402  [R0402]
R139  105K  R-EU_R0201  [R0201]
VREG_18  TPS62087RLTR  [RLT0007A]
VREG_33  LM21212  [HTSSOP20]

### Nets
+3V3 [lcd]: C145.1 C146.1 L2.2 PEXT_33.1 PEXT_33.2 PEXT_33.3 PEXT_33.4 R136.1 ; also sheet 2,4,5,6,7,9,10,11,12,14,15,16,17,18,19
+5V [Power]: C11.1 C109.1 C139.1 C140.1 C141.1 FPGA_1_0.3(DEF) FPGA_1_0.10(AVIN) FPGA_1_0.11(PVIN) FPGA_1_0.12(PVIN) FPGA_1_0.13(EN) R56.2 R129.1 R133.2 R139.1 VREG_18.7(VIN) VREG_33.5(PVIN) VREG_33.6(PVIN) VREG_33.7(PVIN) ; also sheet 2,7,8,9,10,11,12,18,19
GND: C11.2 C12.2 C109.2 C110.2 C112.2 C139.2 C140.2 C141.2 C142.2 C146.2 FPGA_1_0.6(AGND) FPGA_1_0.14(PGND) FPGA_1_0.15(PGND) FPGA_1_0.PAD(AGND) R131.2 R134.1 R137.2 VREG_18.5(GND) VREG_33.8(PGND) VREG_33.9(PGND) VREG_33.10(PGND) VREG_33.20(AGND) VREG_33.TAB(GND) ; also sheet 2,4,5,6,7,8,9,10,11,12,14,15,16,17,18,19
N$9: L3.1 VREG_18.6(SW)
N$64: C111.1 FPGA_1_0.7(CP)
N$72: C111.2 FPGA_1_0.8(CN)
N$73: FPGA_1_0.1(SW) FPGA_1_0.2(SW) L1.1
N$75: C142.1 R133.1 VREG_33.4(AVIN)
N$79: FPGA_1_0.5(FB) R130.2 R131.1
N$83: R134.2 VREG_33.1(FADJ)
N$98: C112.1 FPGA_1_0.9(SS)
N$108: C143.1 C144.1 VREG_33.18(COMP)
N$109: C143.2 R135.2
N$110: C144.2 R135.1 R136.2 R137.1 R138.2 VREG_33.19(FB)
N$113: C145.2 R138.1
PGOOD33: R139.2 VREG_33.17(PGOOD)
PGOOD_10: FPGA_1_0.4(PG) R129.2 VREG_18.1(EN)
PGOOD_18: R56.1 VREG_18.2(PG) VREG_33.3(EN)
SW_OUT: L2.1 VREG_33.11(SW) VREG_33.12(SW) VREG_33.13(SW) VREG_33.14(SW) VREG_33.15(SW) VREG_33.16(SW)
VCCAUX [vccint_aux]: C12.1 L3.2 PEXT_18.1 PEXT_18.2 VREG_18.3(NC) VREG_18.4(VOS) ; also sheet 14,15,19
VCCINT [vccint_aux]: C110.1 FPGA_1_0.16(VOS) L1.2 PEXT_10.1 PEXT_10.2 R130.1 ; also sheet 14,19
Unconnected: VREG_33.2(SS/TRK)

### Notes on the sheet
- Power supply notes
- Power sequence is
    1.0v rail @ 2A, which enables the
    1.8v rail @ 1A, which enables the
    3.3v rail @ 1A
  
  Both 1.8v and 3.3v need no minimum load
  All regulators are stable with ceramic caps
- R131 and R130 ought to be at
  least 1%, preferably 0.1% resistors
- Recommended Parts
- C139
  C140
  C141
  C142
  C143
  C144
  C145
  C146
  R133
  R134
  R135
  R136
  R137
  R138
  R139
  L2
- VCCIO @ 3.3v
- VCCINT @ 1.0v | VCCAUX @ 1.8v
- Recommended Parts
- C11
  C12
  L3
  R56
- FPGA power supplies

## Sheet 14 of 19: FPGA bypass
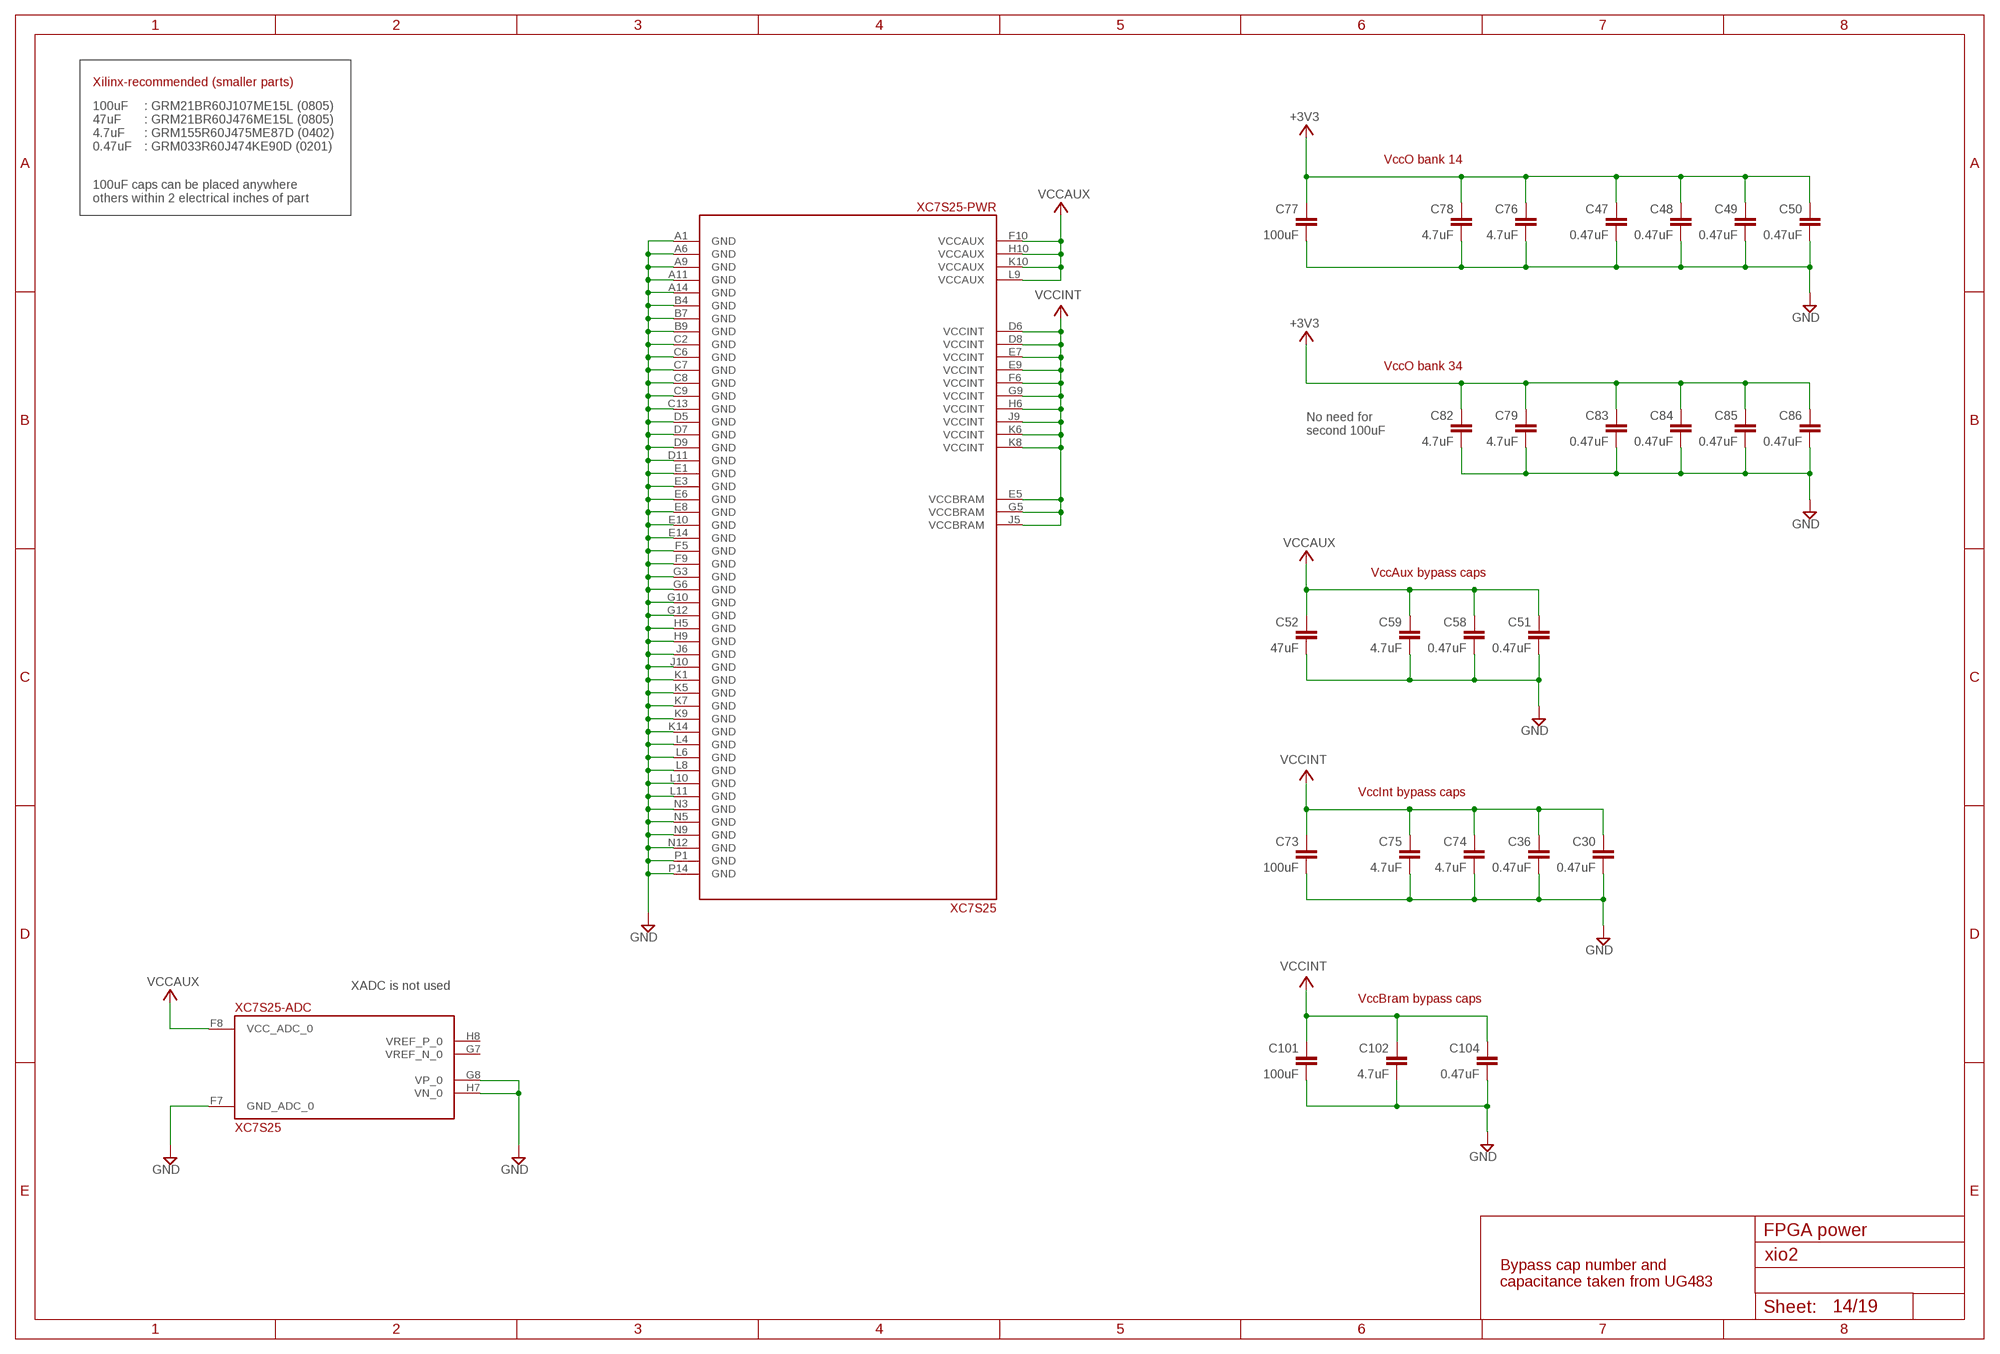
[diagram p13: schematic, sheet 14]

### Parts
C30  0.47uF  C-EUC0201  [C0201]
C36  0.47uF  C-EUC0201  [C0201]
C47  0.47uF  C-EUC0201  [C0201]
C48  0.47uF  C-EUC0201  [C0201]
C49  0.47uF  C-EUC0201  [C0201]
C50  0.47uF  C-EUC0201  [C0201]
C51  0.47uF  C-EUC0201  [C0201]
C52  47uF  C-EUC0805  [C0805]
C58  0.47uF  C-EUC0201  [C0201]
C59  4.7uF  C-EUC0402  [C0402]
C73  100uF  C-EUC0805  [C0805]
C74  4.7uF  C-EUC0402  [C0402]
C75  4.7uF  C-EUC0402  [C0402]
C76  4.7uF  C-EUC0402  [C0402]
C77  100uF  C-EUC0805  [C0805]
C78  4.7uF  C-EUC0402  [C0402]
C79  4.7uF  C-EUC0402  [C0402]
C82  4.7uF  C-EUC0402  [C0402]
C83  0.47uF  C-EUC0201  [C0201]
C84  0.47uF  C-EUC0201  [C0201]
C85  0.47uF  C-EUC0201  [C0201]
C86  0.47uF  C-EUC0201  [C0201]
C101  100uF  C-EUC0805  [C0805]
C102  4.7uF  C-EUC0402  [C0402]
C104  0.47uF  C-EUC0201  [C0201]
XC7S25  XC7S25  [BGA196C100P14X14_1500X1500X146]

### Nets
+3V3 [lcd]: C47.1 C48.1 C49.1 C50.1 C76.1 C77.1 C78.1 C79.1 C82.1 C83.1 C84.1 C85.1 C86.1 ; also sheet 2,4,5,6,7,9,10,11,12,13,15,16,17,18,19
GND: C30.2 C36.2 C47.2 C48.2 C49.2 C50.2 C51.2 C52.2 C58.2 C59.2 C73.2 C74.2 C75.2 C76.2 C77.2 C78.2 C79.2 C82.2 C83.2 C84.2 C85.2 C86.2 C101.2 C102.2 C104.2 XC7S25.A1(-PWR:GND) XC7S25.A6(-PWR:GND) XC7S25.A9(-PWR:GND) XC7S25.A11(-PWR:GND) XC7S25.A14(-PWR:GND) XC7S25.B4(-PWR:GND) XC7S25.B7(-PWR:GND) XC7S25.B9(-PWR:GND) XC7S25.C2(-PWR:GND) XC7S25.C6(-PWR:GND) XC7S25.C7(-PWR:GND) XC7S25.C8(-PWR:GND) XC7S25.C9(-PWR:GND) XC7S25.C13(-PWR:GND) XC7S25.D5(-PWR:GND) XC7S25.D7(-PWR:GND) XC7S25.D9(-PWR:GND) XC7S25.D11(-PWR:GND) XC7S25.E1(-PWR:GND) XC7S25.E3(-PWR:GND) XC7S25.E6(-PWR:GND) XC7S25.E8(-PWR:GND) XC7S25.E10(-PWR:GND) XC7S25.E14(-PWR:GND) XC7S25.F5(-PWR:GND) XC7S25.F7(-ADC:GND_ADC_0) XC7S25.F9(-PWR:GND) XC7S25.G3(-PWR:GND) XC7S25.G6(-PWR:GND) XC7S25.G8(-ADC:VP_0) XC7S25.G10(-PWR:GND) XC7S25.G12(-PWR:GND) XC7S25.H5(-PWR:GND) XC7S25.H7(-ADC:VN_0) XC7S25.H9(-PWR:GND) XC7S25.J6(-PWR:GND) XC7S25.J10(-PWR:GND) XC7S25.K1(-PWR:GND) XC7S25.K5(-PWR:GND) XC7S25.K7(-PWR:GND) XC7S25.K9(-PWR:GND) XC7S25.K14(-PWR:GND) XC7S25.L4(-PWR:GND) XC7S25.L6(-PWR:GND) XC7S25.L8(-PWR:GND) XC7S25.L10(-PWR:GND) XC7S25.L11(-PWR:GND) XC7S25.N3(-PWR:GND) XC7S25.N5(-PWR:GND) XC7S25.N9(-PWR:GND) XC7S25.N12(-PWR:GND) XC7S25.P1(-PWR:GND) XC7S25.P14(-PWR:GND) ; also sheet 2,4,5,6,7,8,9,10,11,12,13,15,16,17,18,19
VCCAUX [vccint_aux]: C51.1 C52.1 C58.1 C59.1 XC7S25.F8(-ADC:VCC_ADC_0) XC7S25.F10(-PWR:VCCAUX) XC7S25.H10(-PWR:VCCAUX) XC7S25.K10(-PWR:VCCAUX) XC7S25.L9(-PWR:VCCAUX) ; also sheet 13,15,19
VCCINT [vccint_aux]: C30.1 C36.1 C73.1 C74.1 C75.1 C101.1 C102.1 C104.1 XC7S25.D6(-PWR:VCCINT) XC7S25.D8(-PWR:VCCINT) XC7S25.E5(-PWR:VCCBRAM) XC7S25.E7(-PWR:VCCINT) XC7S25.E9(-PWR:VCCINT) XC7S25.F6(-PWR:VCCINT) XC7S25.G5(-PWR:VCCBRAM) XC7S25.G9(-PWR:VCCINT) XC7S25.H6(-PWR:VCCINT) XC7S25.J5(-PWR:VCCBRAM) XC7S25.J9(-PWR:VCCINT) XC7S25.K6(-PWR:VCCINT) XC7S25.K8(-PWR:VCCINT) ; also sheet 13,19
Unconnected: XC7S25.G7(-ADC:VREF_N_0) XC7S25.H8(-ADC:VREF_P_0)

### Notes on the sheet
- Xilinx-recommended (smaller parts)
- 100uF
  47uF
  4.7uF
  0.47uF
- : GRM21BR60J107ME15L (0805)  
  : GRM21BR60J476ME15L (0805)
  : GRM155R60J475ME87D (0402)
  : GRM033R60J474KE90D (0201)
- VccO bank 14
- 100uF caps can be placed anywhere
  others within 2 electrical inches of part
- VccO bank 34
- No need for 
  second 100uF
- VccAux bypass caps
- VccInt bypass caps
- XADC is not used
- VccBram bypass caps
- FPGA power
- Bypass cap number and
  capacitance taken from UG483

## Sheet 15 of 19: FPGA config, clock
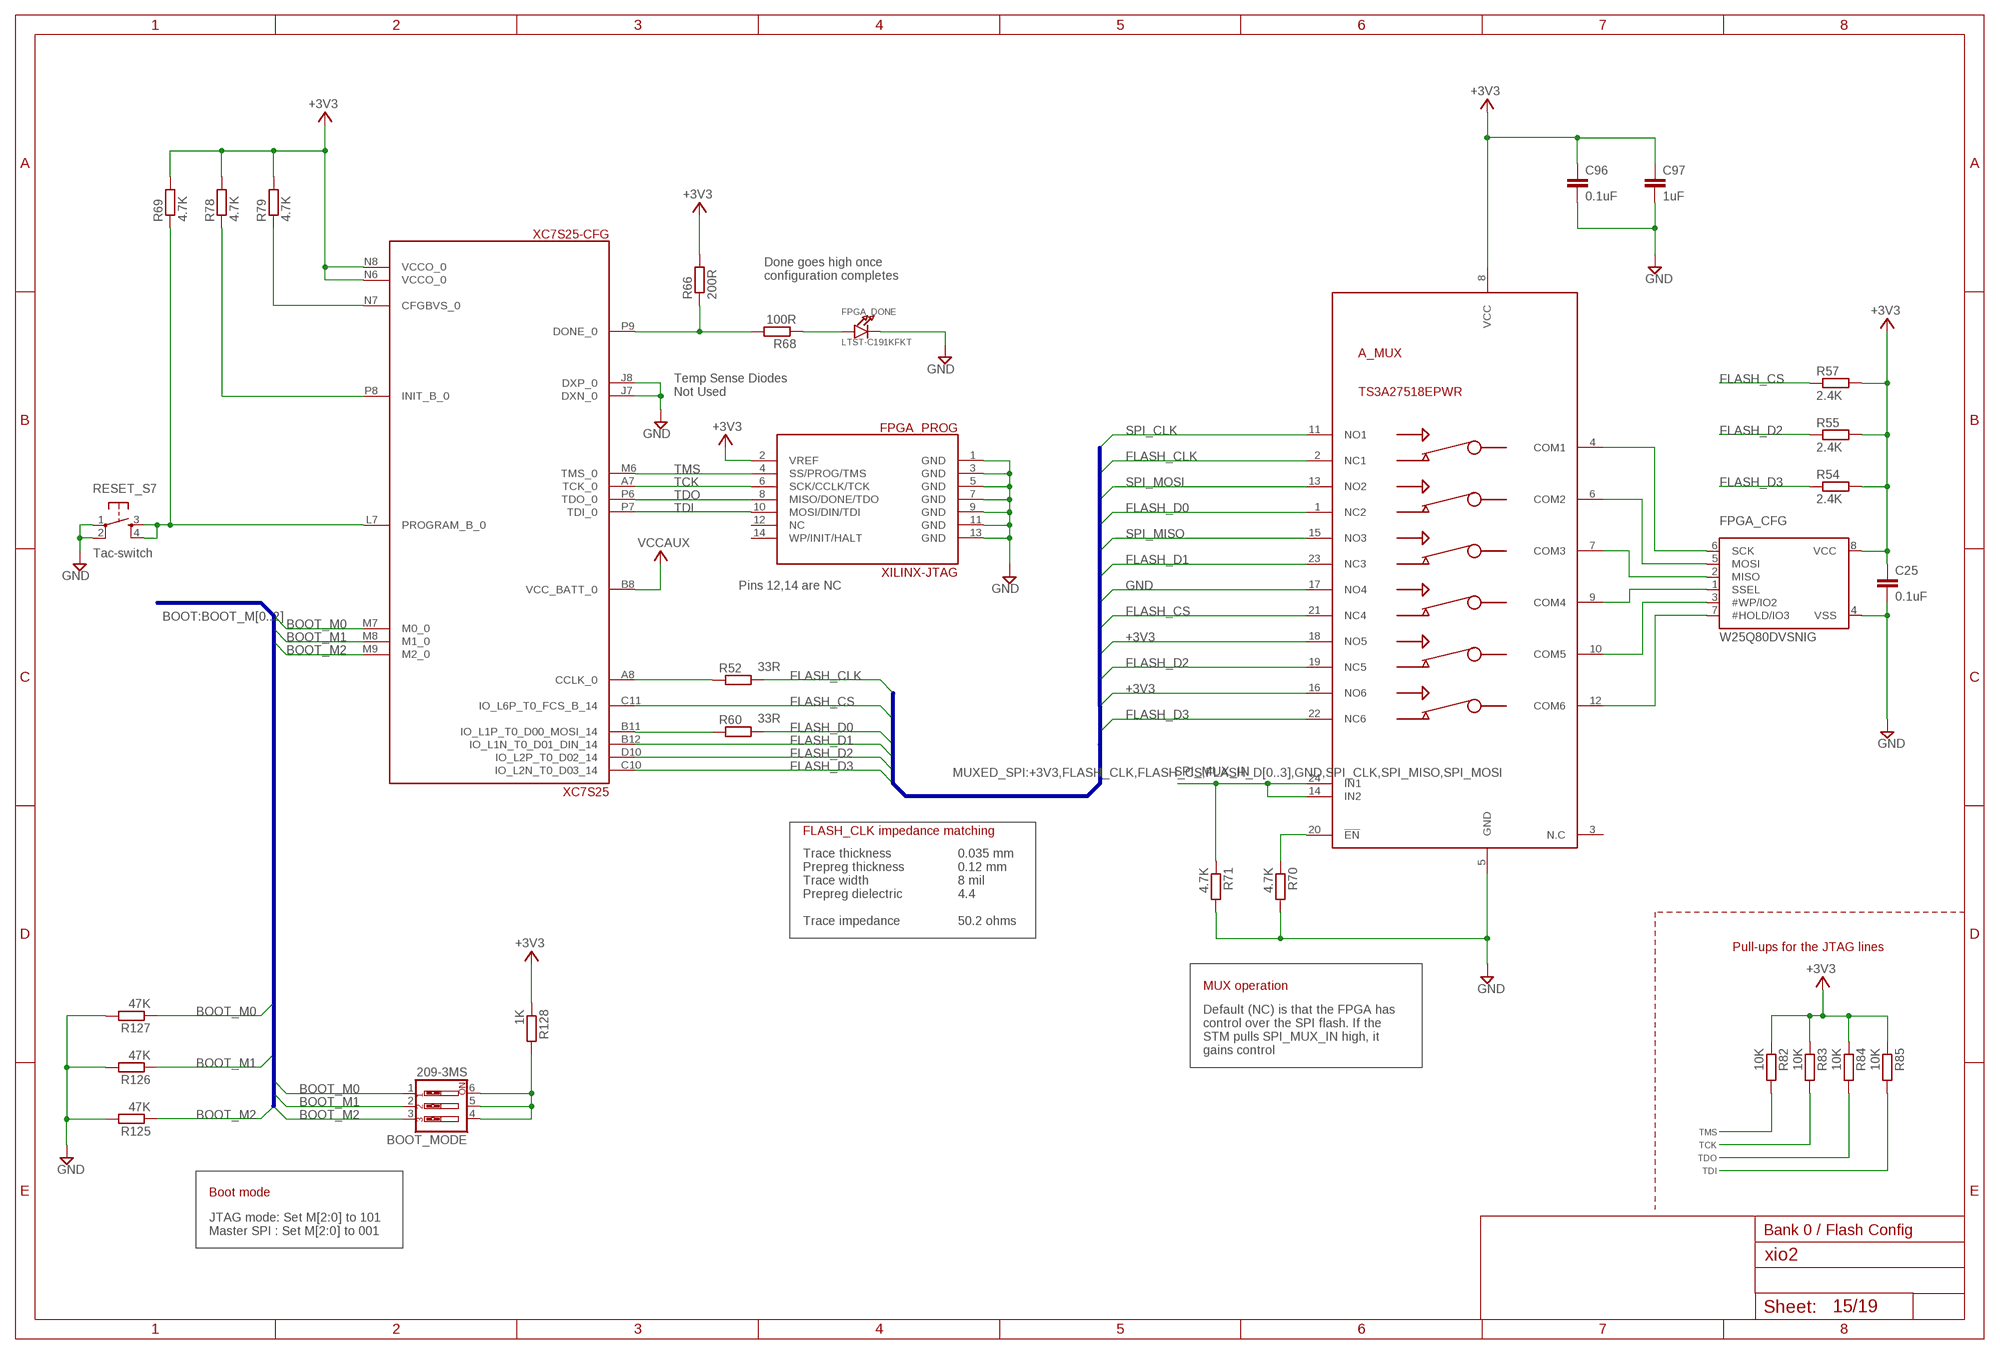
[diagram p14: schematic, sheet 15]

### Parts
A_MUX  TS3A27518EPWR  TS3A27518E  [TSSOP24]
BOOT_MODE  209-3MS  SW_DIP-3  [EDG-03]
C25  0.1uF  C-EUC0201  [C0201]
C96  0.1uF  C-EUC0201  [C0201]
C97  1uF  C-EUC0201  [C0201]
FPGA_CFG  W25Q80DVSNIG  SPIFLASH_SOIC8  [SOIC8_150MIL]
FPGA_DONE  LTST-C191KFKT  LED0603  [CHIPLED_0603]
FPGA_PROG  XILINX-JTAG  [332-14]
R52  33R  R-EU_R0201  [R0201]
R54  2.4K  R-EU_R0201  [R0201]
R55  2.4K  R-EU_R0201  [R0201]
R57  2.4K  R-EU_R0201  [R0201]
R60  33R  R-EU_R0201  [R0201]
R66  200R  R-EU_R0201  [R0201]
R68  100R  R-EU_R0402  [R0402]
R69  4.7K  R-EU_R0201  [R0201]
R70  4.7K  R-EU_R0201  [R0201]
R71  4.7K  R-EU_R0201  [R0201]
R78  4.7K  R-EU_R0201  [R0201]
R79  4.7K  R-EU_R0201  [R0201]
R82  10K  R-EU_R0201  [R0201]
R83  10K  R-EU_R0201  [R0201]
R84  10K  R-EU_R0201  [R0201]
R85  10K  R-EU_R0201  [R0201]
R125  47K  R-EU_R0201  [R0201]
R126  47K  R-EU_R0201  [R0201]
R127  47K  R-EU_R0201  [R0201]
R128  1K  R-EU_R0201  [R0201]
RESET_S7  Tac-switch  TAC_SWITCHPTH  [TACTILE-PTH]

### Nets
+3V3 [lcd]: A_MUX.8(VCC) A_MUX.16(NO6) A_MUX.18(NO5) C25.1 C96.1 C97.1 FPGA_CFG.8(VCC) FPGA_PROG.2(VREF) R54.2 R55.2 R57.2 R66.2 R69.2 R78.2 R79.2 R82.1 R83.1 R84.1 R85.1 R128.1 XC7S25.N6(-CFG:VCCO_0) XC7S25.N8(-CFG:VCCO_0) ; also sheet 2,4,5,6,7,9,10,11,12,13,14,16,17,18,19
BOOT_M0: BOOT_MODE.1 R127.1 XC7S25.M7(-CFG:M0_0)
BOOT_M1: BOOT_MODE.2 R126.1 XC7S25.M8(-CFG:M1_0)
BOOT_M2: BOOT_MODE.3 R125.1 XC7S25.M9(-CFG:M2_0)
FLASH_CLK [cclk50]: A_MUX.2(NC1) R52.2
FLASH_CS [cclk50]: A_MUX.21(NC4) R57.1 XC7S25.C11(-CFG:IO_L6P_T0_FCS_B_14)
FLASH_D0 [cclk50]: A_MUX.1(NC2) R60.2
FLASH_D1 [cclk50]: A_MUX.23(NC3) XC7S25.B12(-CFG:IO_L1N_T0_D01_DIN_14)
FLASH_D2 [cclk50]: A_MUX.19(NC5) R55.1 XC7S25.D10(-CFG:IO_L2P_T0_D02_14)
FLASH_D3 [cclk50]: A_MUX.22(NC6) R54.1 XC7S25.C10(-CFG:IO_L2N_T0_D03_14)
GND: A_MUX.5(GND) A_MUX.17(NO4) C25.2 C96.2 C97.2 FPGA_CFG.4(VSS) FPGA_DONE.C FPGA_PROG.1(GND) FPGA_PROG.3(GND) FPGA_PROG.5(GND) FPGA_PROG.7(GND) FPGA_PROG.9(GND) FPGA_PROG.11(GND) FPGA_PROG.13(GND) R70.2 R71.2 R125.2 R126.2 R127.2 RESET_S7.1 RESET_S7.2 XC7S25.J7(-CFG:DXN_0) XC7S25.J8(-CFG:DXP_0) ; also sheet 2,4,5,6,7,8,9,10,11,12,13,14,16,17,18,19
N$3: R60.1 XC7S25.B11(-CFG:IO_L1P_T0_D00_MOSI_14)
N$4 [qspi]: A_MUX.4(COM1) FPGA_CFG.6(SCK)
N$50 [lcd]: BOOT_MODE.4 BOOT_MODE.5 BOOT_MODE.6 R128.2
N$51: R52.1 XC7S25.A8(-CFG:CCLK_0)
N$55: R66.1 R68.2 XC7S25.P9(-CFG:DONE_0)
N$56: FPGA_DONE.A R68.1
N$62 [qspi]: A_MUX.6(COM2) FPGA_CFG.5(MOSI)
N$63 [qspi]: A_MUX.7(COM3) FPGA_CFG.2(MISO)
N$66 [qspi]: A_MUX.9(COM4) FPGA_CFG.1(SSEL)
N$67 [qspi]: A_MUX.10(COM5) FPGA_CFG.3(#WP/IO2)
N$68 [qspi]: A_MUX.12(COM6) FPGA_CFG.7(#HOLD/IO3)
N$69: R69.1 RESET_S7.3 RESET_S7.4 XC7S25.L7(-CFG:PROGRAM_B_0)
N$70: R78.1 XC7S25.P8(-CFG:INIT_B_0)
N$71: A_MUX.20(!EN!) R70.1
N$77: R79.1 XC7S25.N7(-CFG:CFGBVS_0)
SPI_CLK [spi]: A_MUX.11(NO1) ; also sheet 3,6,10,11,12
SPI_MISO [spi]: A_MUX.15(NO3) ; also sheet 3,6,10,11,12
SPI_MOSI [spi]: A_MUX.13(NO2) ; also sheet 3,6,10,11,12
SPI_MUX_IN [spi]: A_MUX.14(IN2) A_MUX.24(IN1) R71.1 ; also sheet 3
TCK: FPGA_PROG.6(SCK/CCLK/TCK) R83.2 XC7S25.A7(-CFG:TCK_0)
TDI: FPGA_PROG.10(MOSI/DIN/TDI) R85.2 XC7S25.P7(-CFG:TDI_0)
TDO: FPGA_PROG.8(MISO/DONE/TDO) R84.2 XC7S25.P6(-CFG:TDO_0)
TMS: FPGA_PROG.4(SS/PROG/TMS) R82.2 XC7S25.M6(-CFG:TMS_0)
VCCAUX [vccint_aux]: XC7S25.B8(-CFG:VCC_BATT_0) ; also sheet 13,14,19
Unconnected: A_MUX.3(N.C) FPGA_PROG.12(NC) FPGA_PROG.14(WP/INIT/HALT)

### Buses
MUXED_SPI:+3V3,FLASH_CLK,FLASH_CS,FLASH_D[0..3],GND,SPI_CLK,SPI_MISO,SPI_MOSI
BOOT:BOOT_M[0..2]

### Notes on the sheet
- Done goes high once
  configuration completes
- Temp Sense Diodes
  Not Used
- Pins 12,14 are NC
- FLASH_CLK impedance matching
- Trace thickness
  Prepreg thickness
  Trace width
  Prepreg dielectric
  
  Trace impedance
- 0.035 mm
  0.12 mm
  8 mil
  4.4
  
  50.2 ohms
- Pull-ups for the JTAG lines
- MUX operation
- Default (NC) is that the FPGA has
  control over the SPI flash. If the
  STM pulls SPI_MUX_IN high, it
  gains control
- Boot mode
- JTAG mode: Set M[2:0] to 101
  Master SPI : Set M[2:0] to 001
- Bank 0 / Flash Config